# EAGLE board tc08nh (EAGLE 6.6.0), part 1 of 5
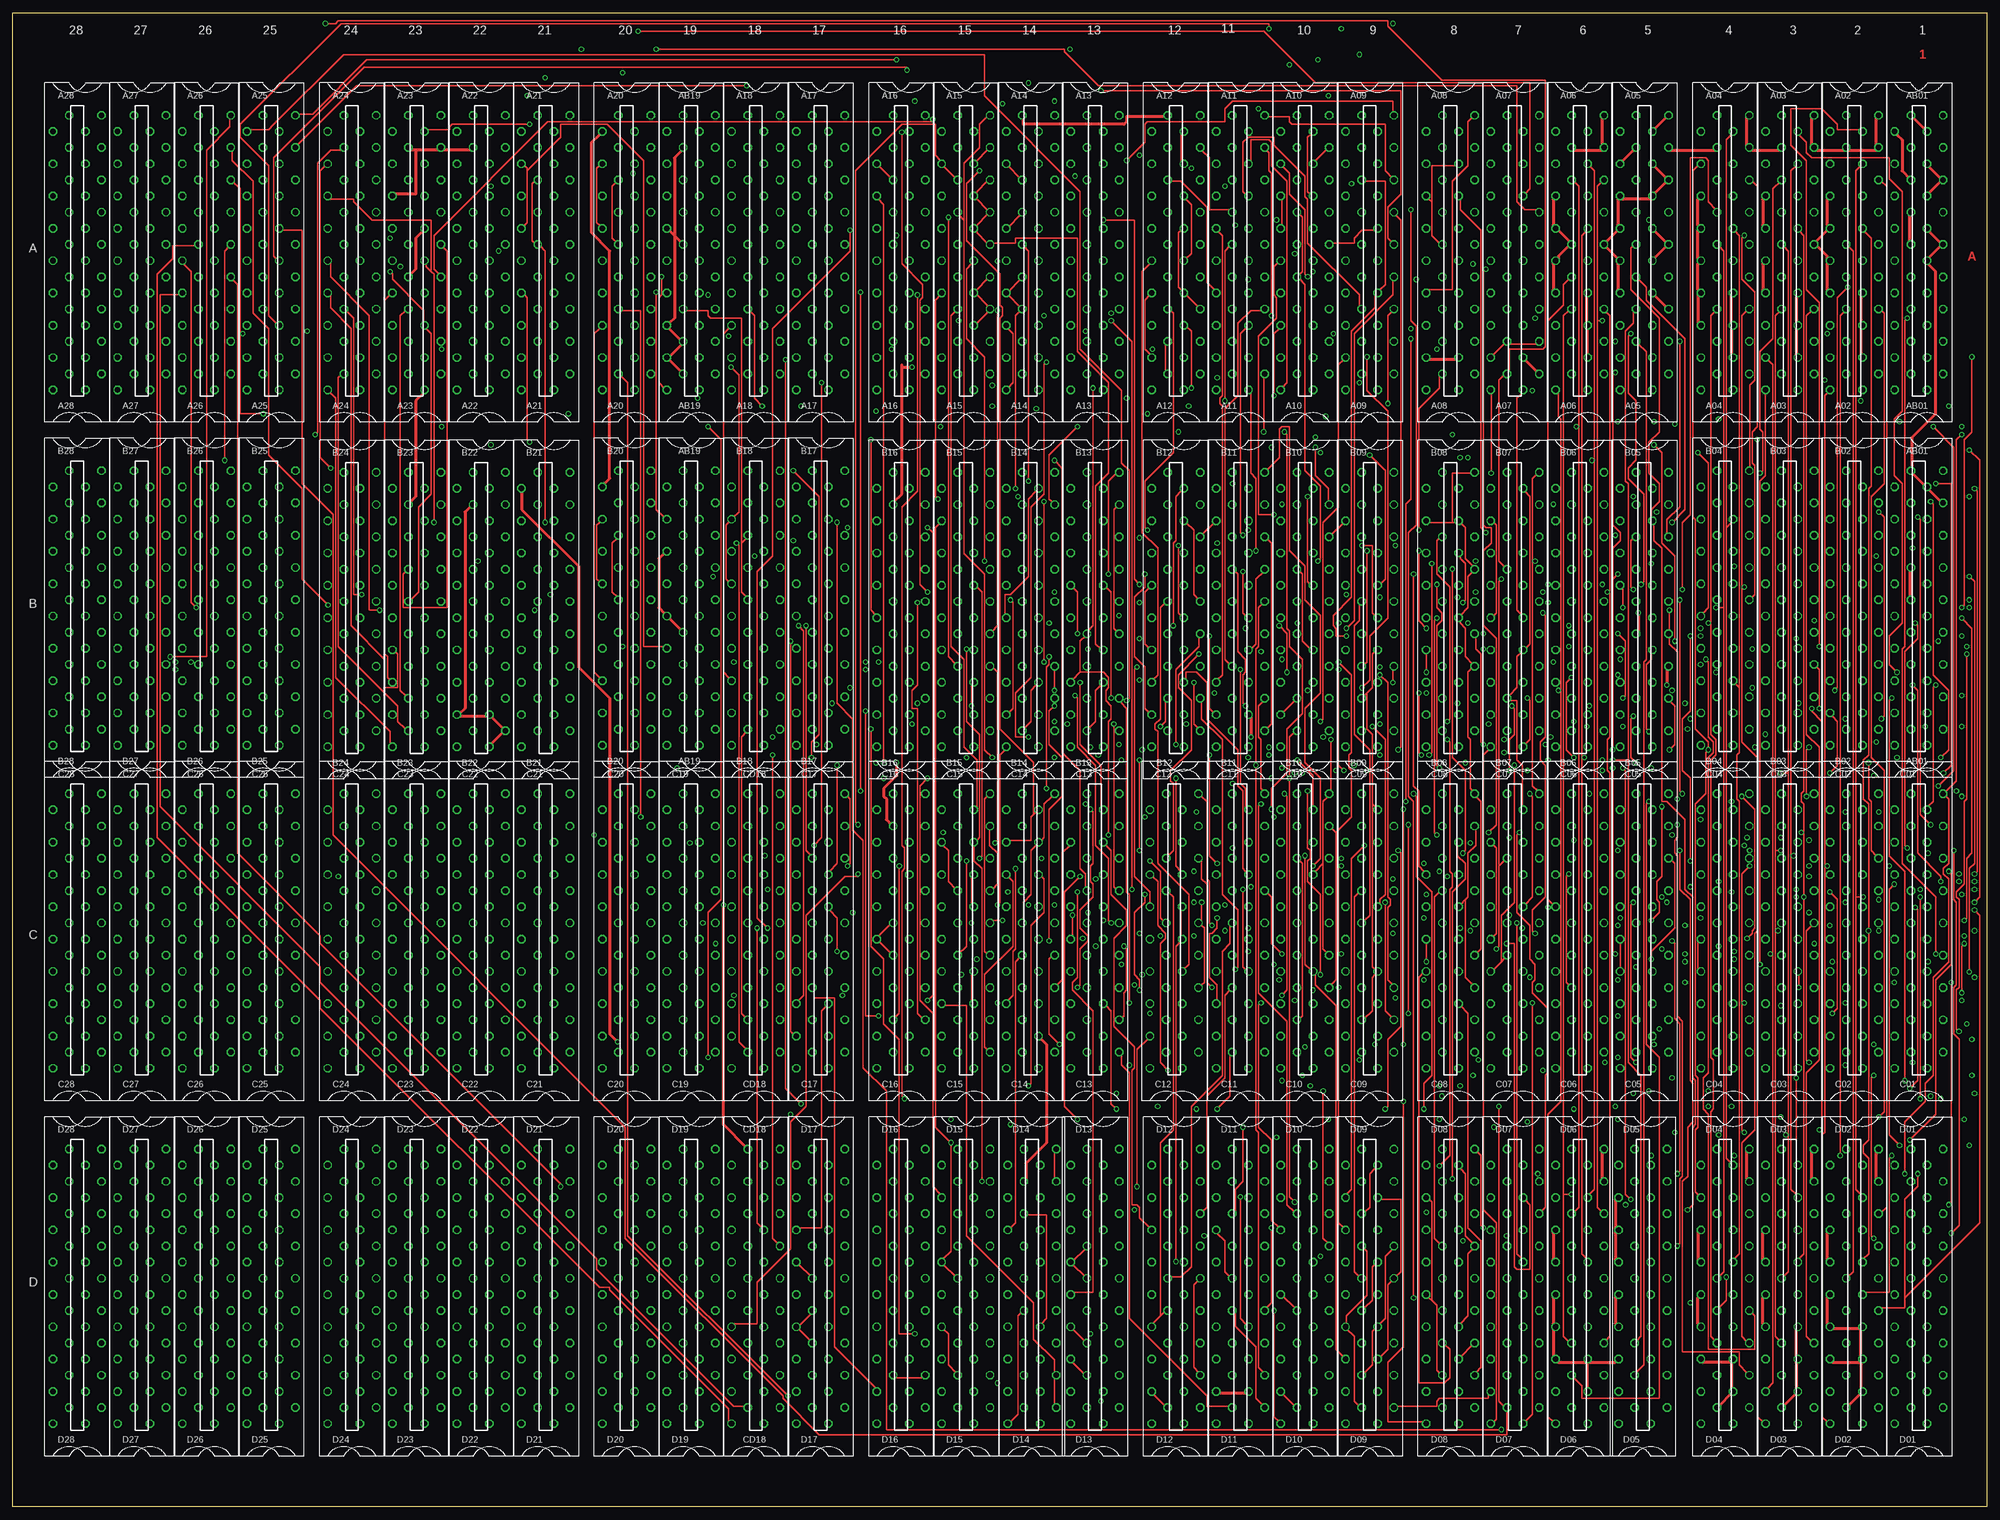
[diagram p12: board, top side]
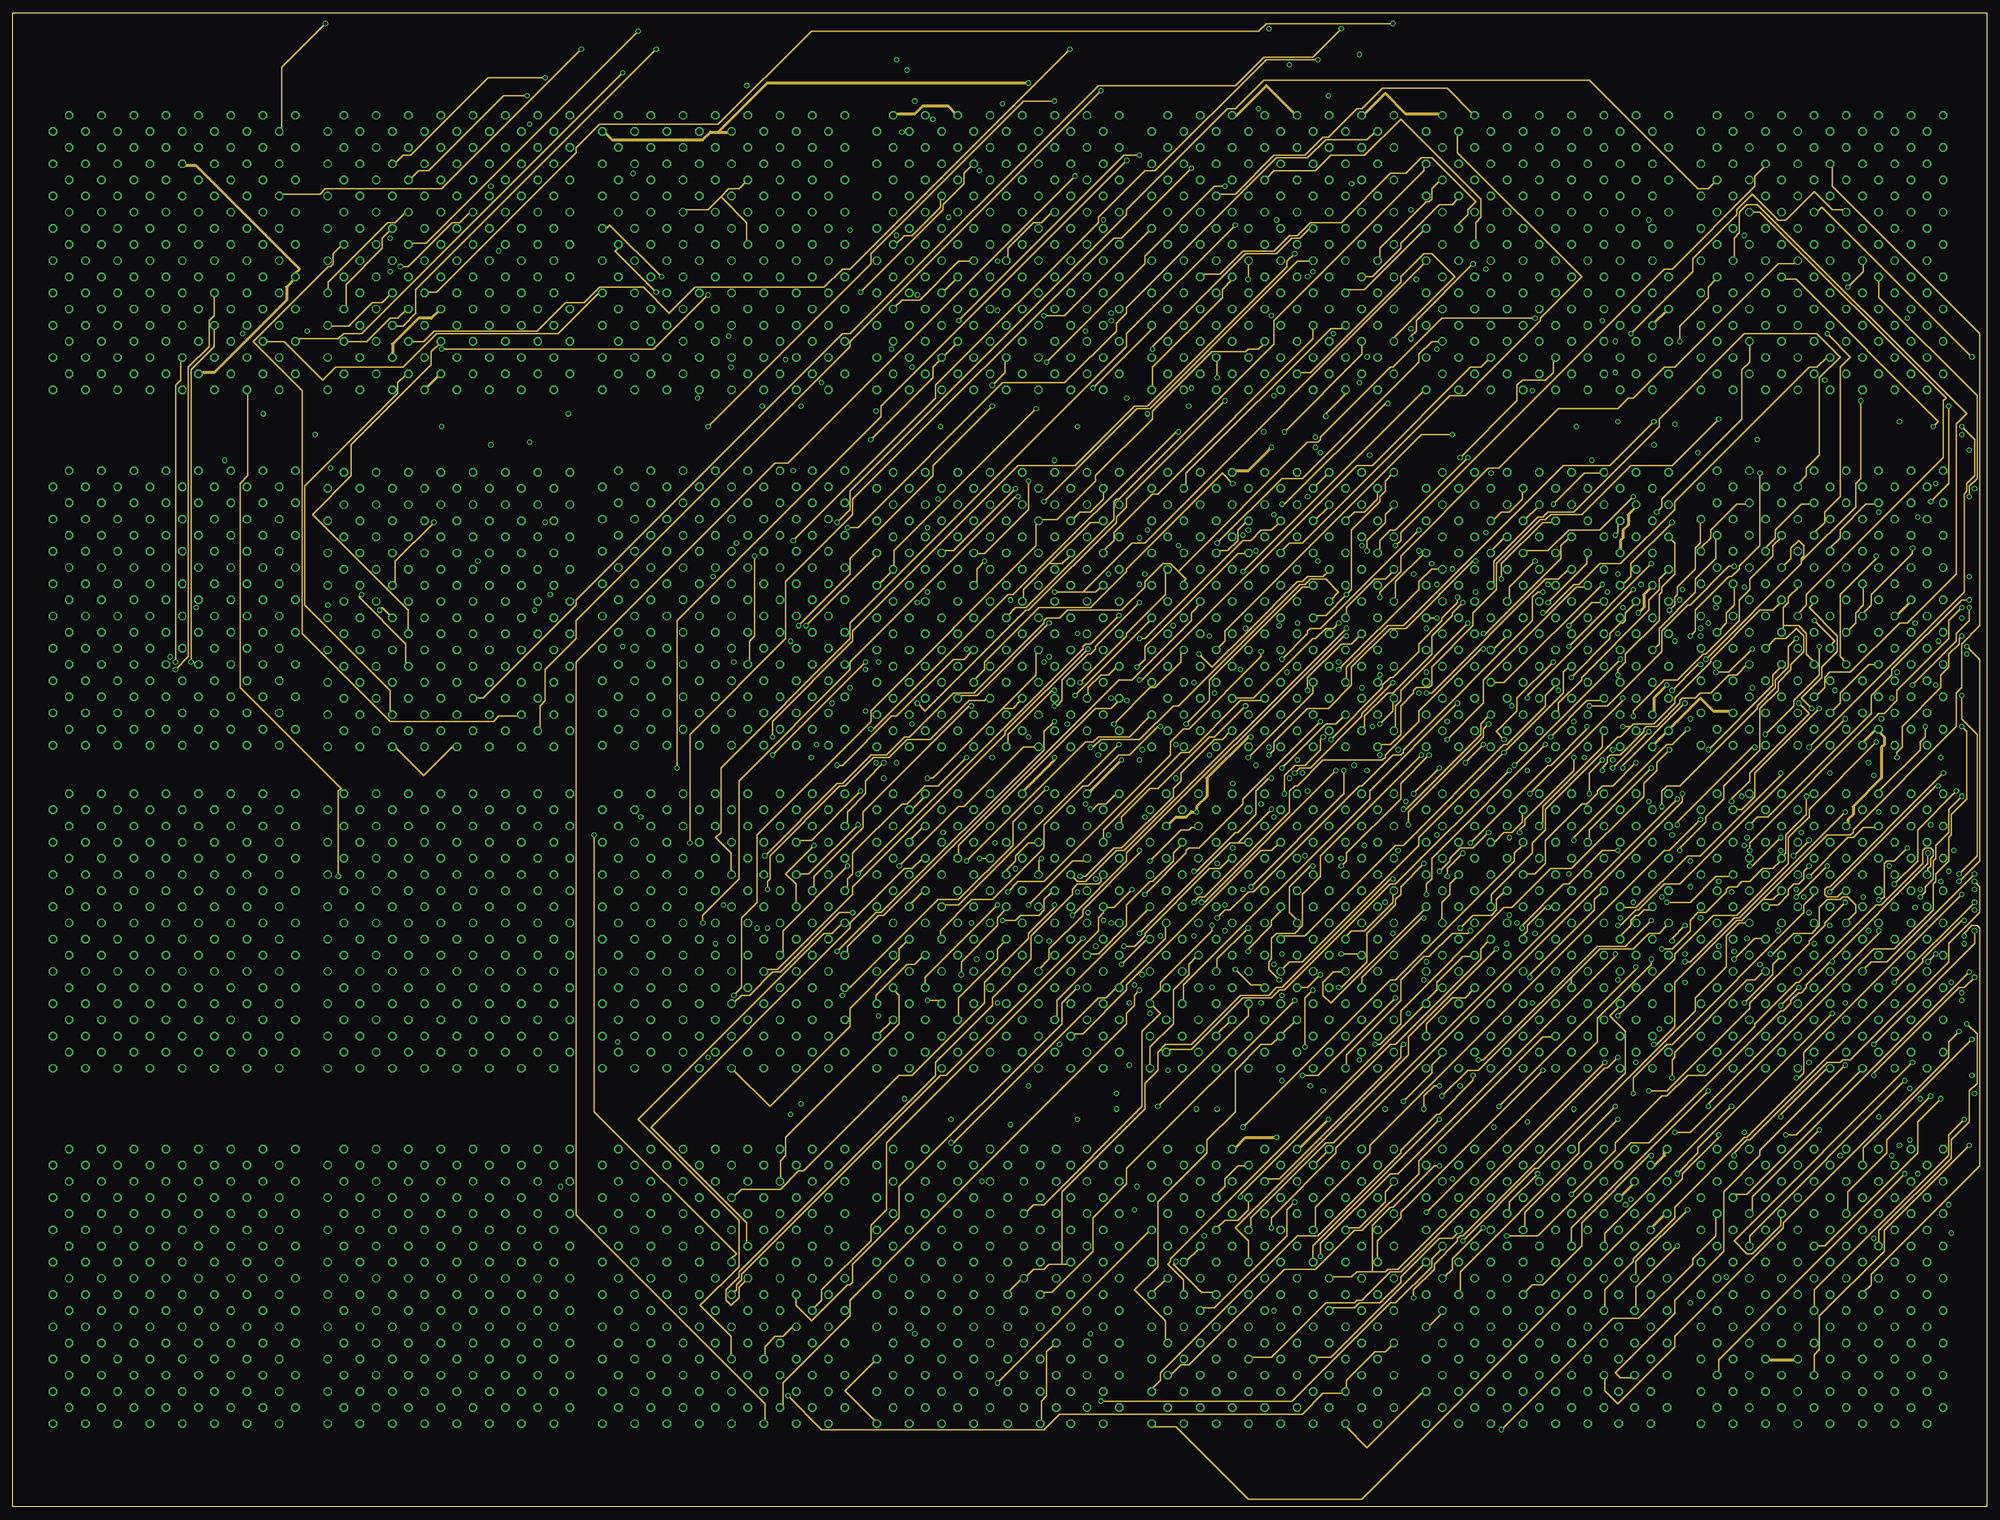
[diagram p13: board, inner layer Route2]
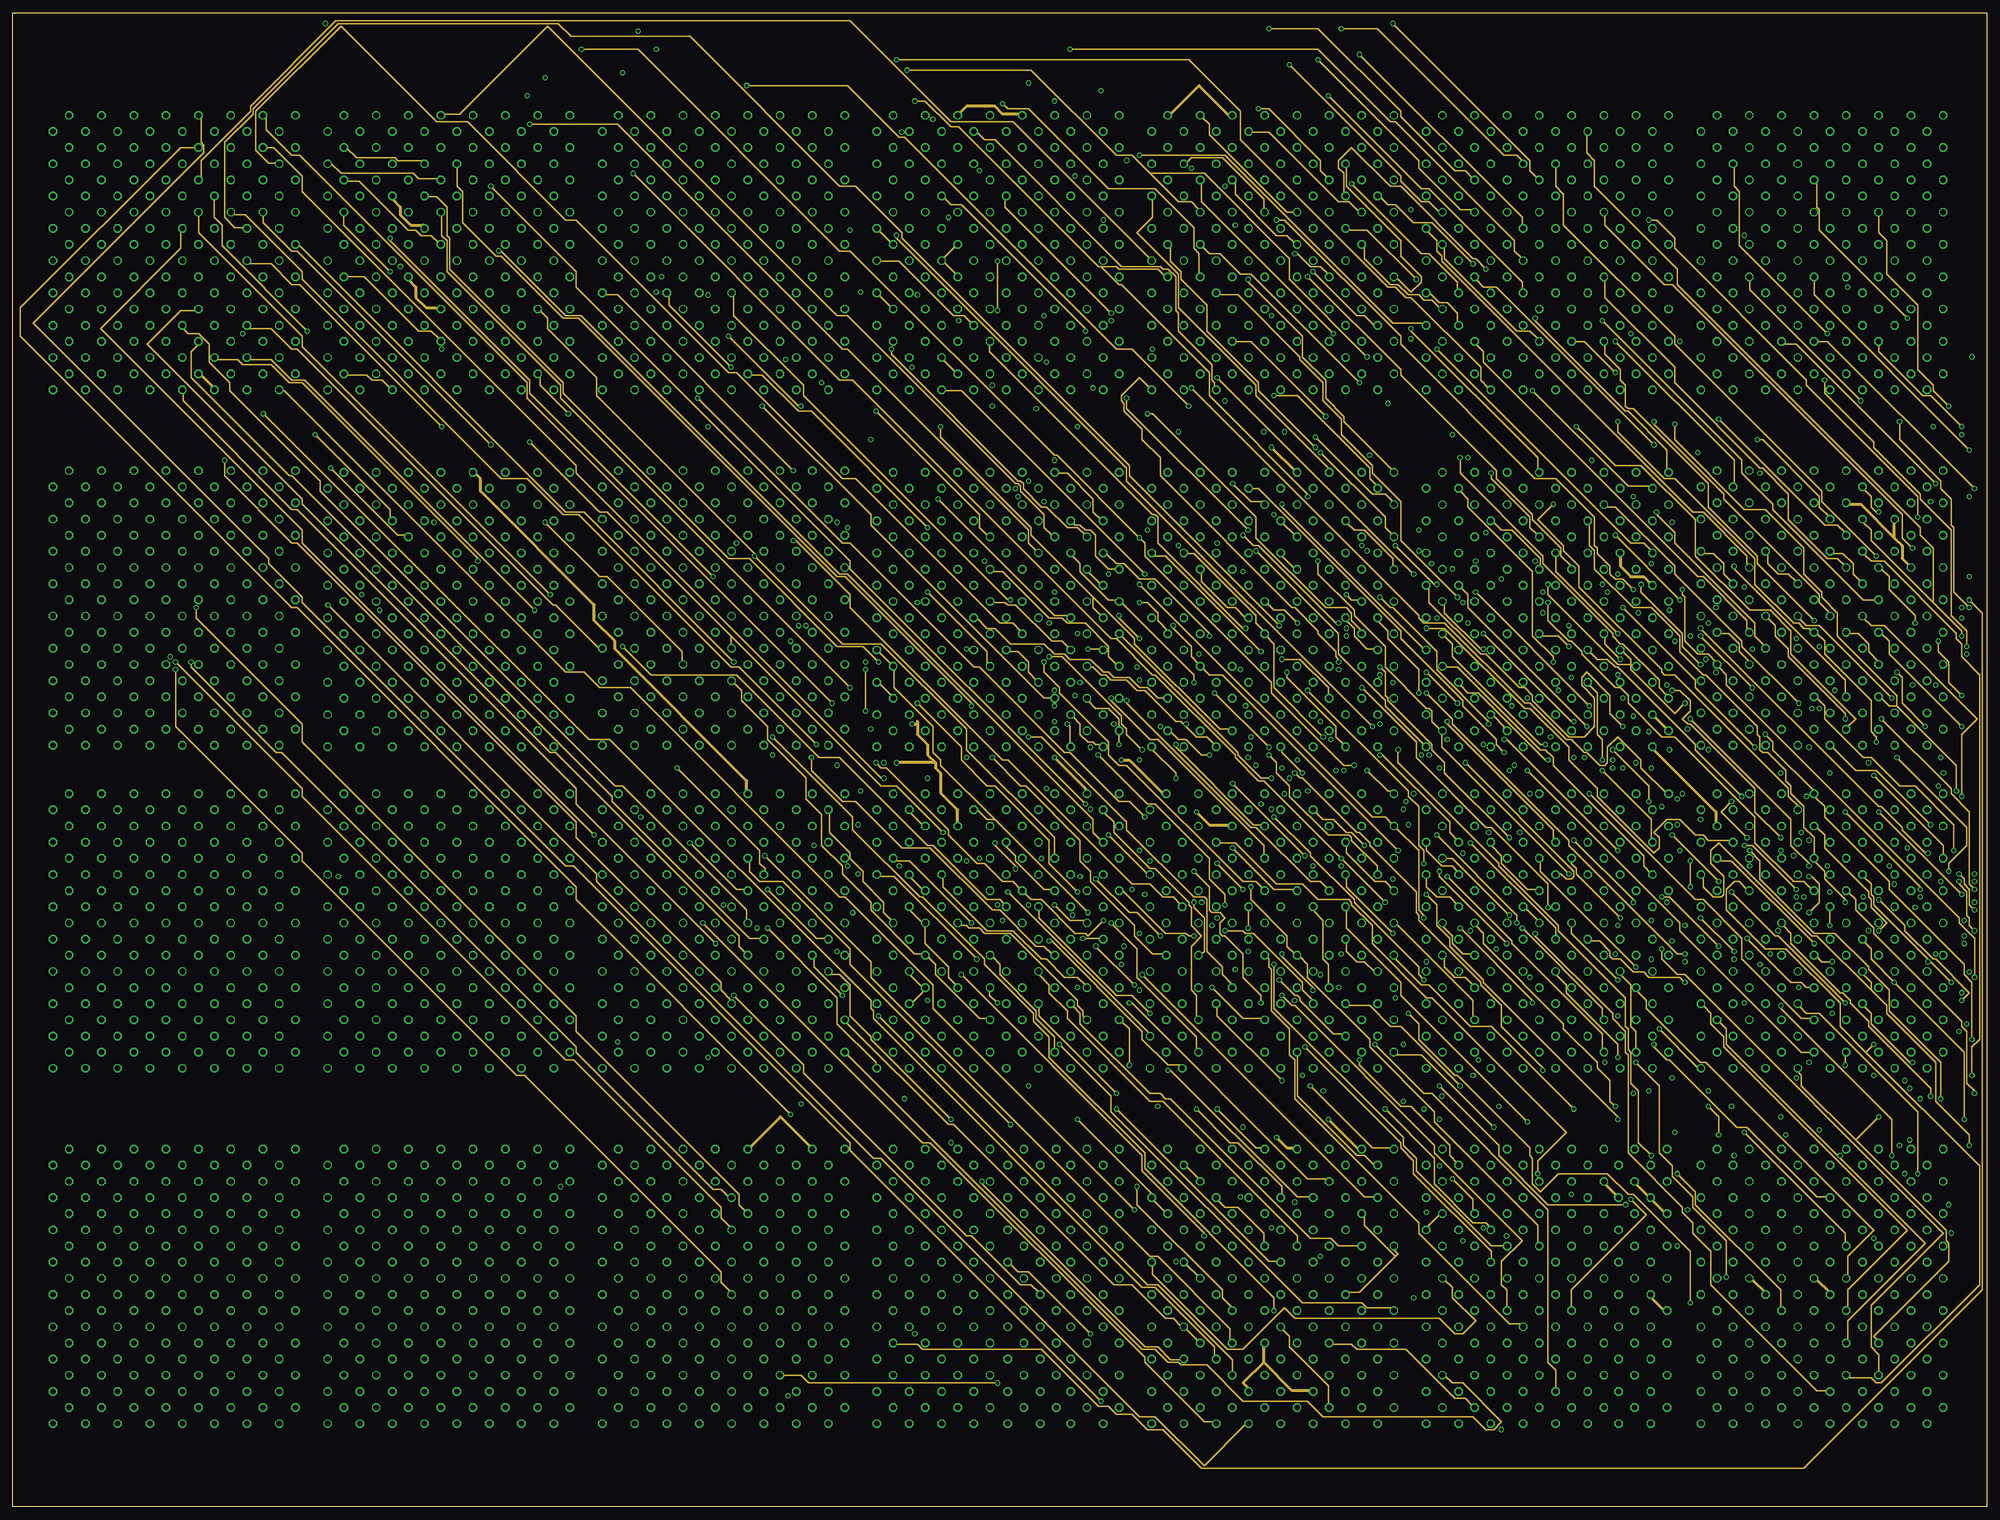
[diagram p14: board, inner layer Route15]
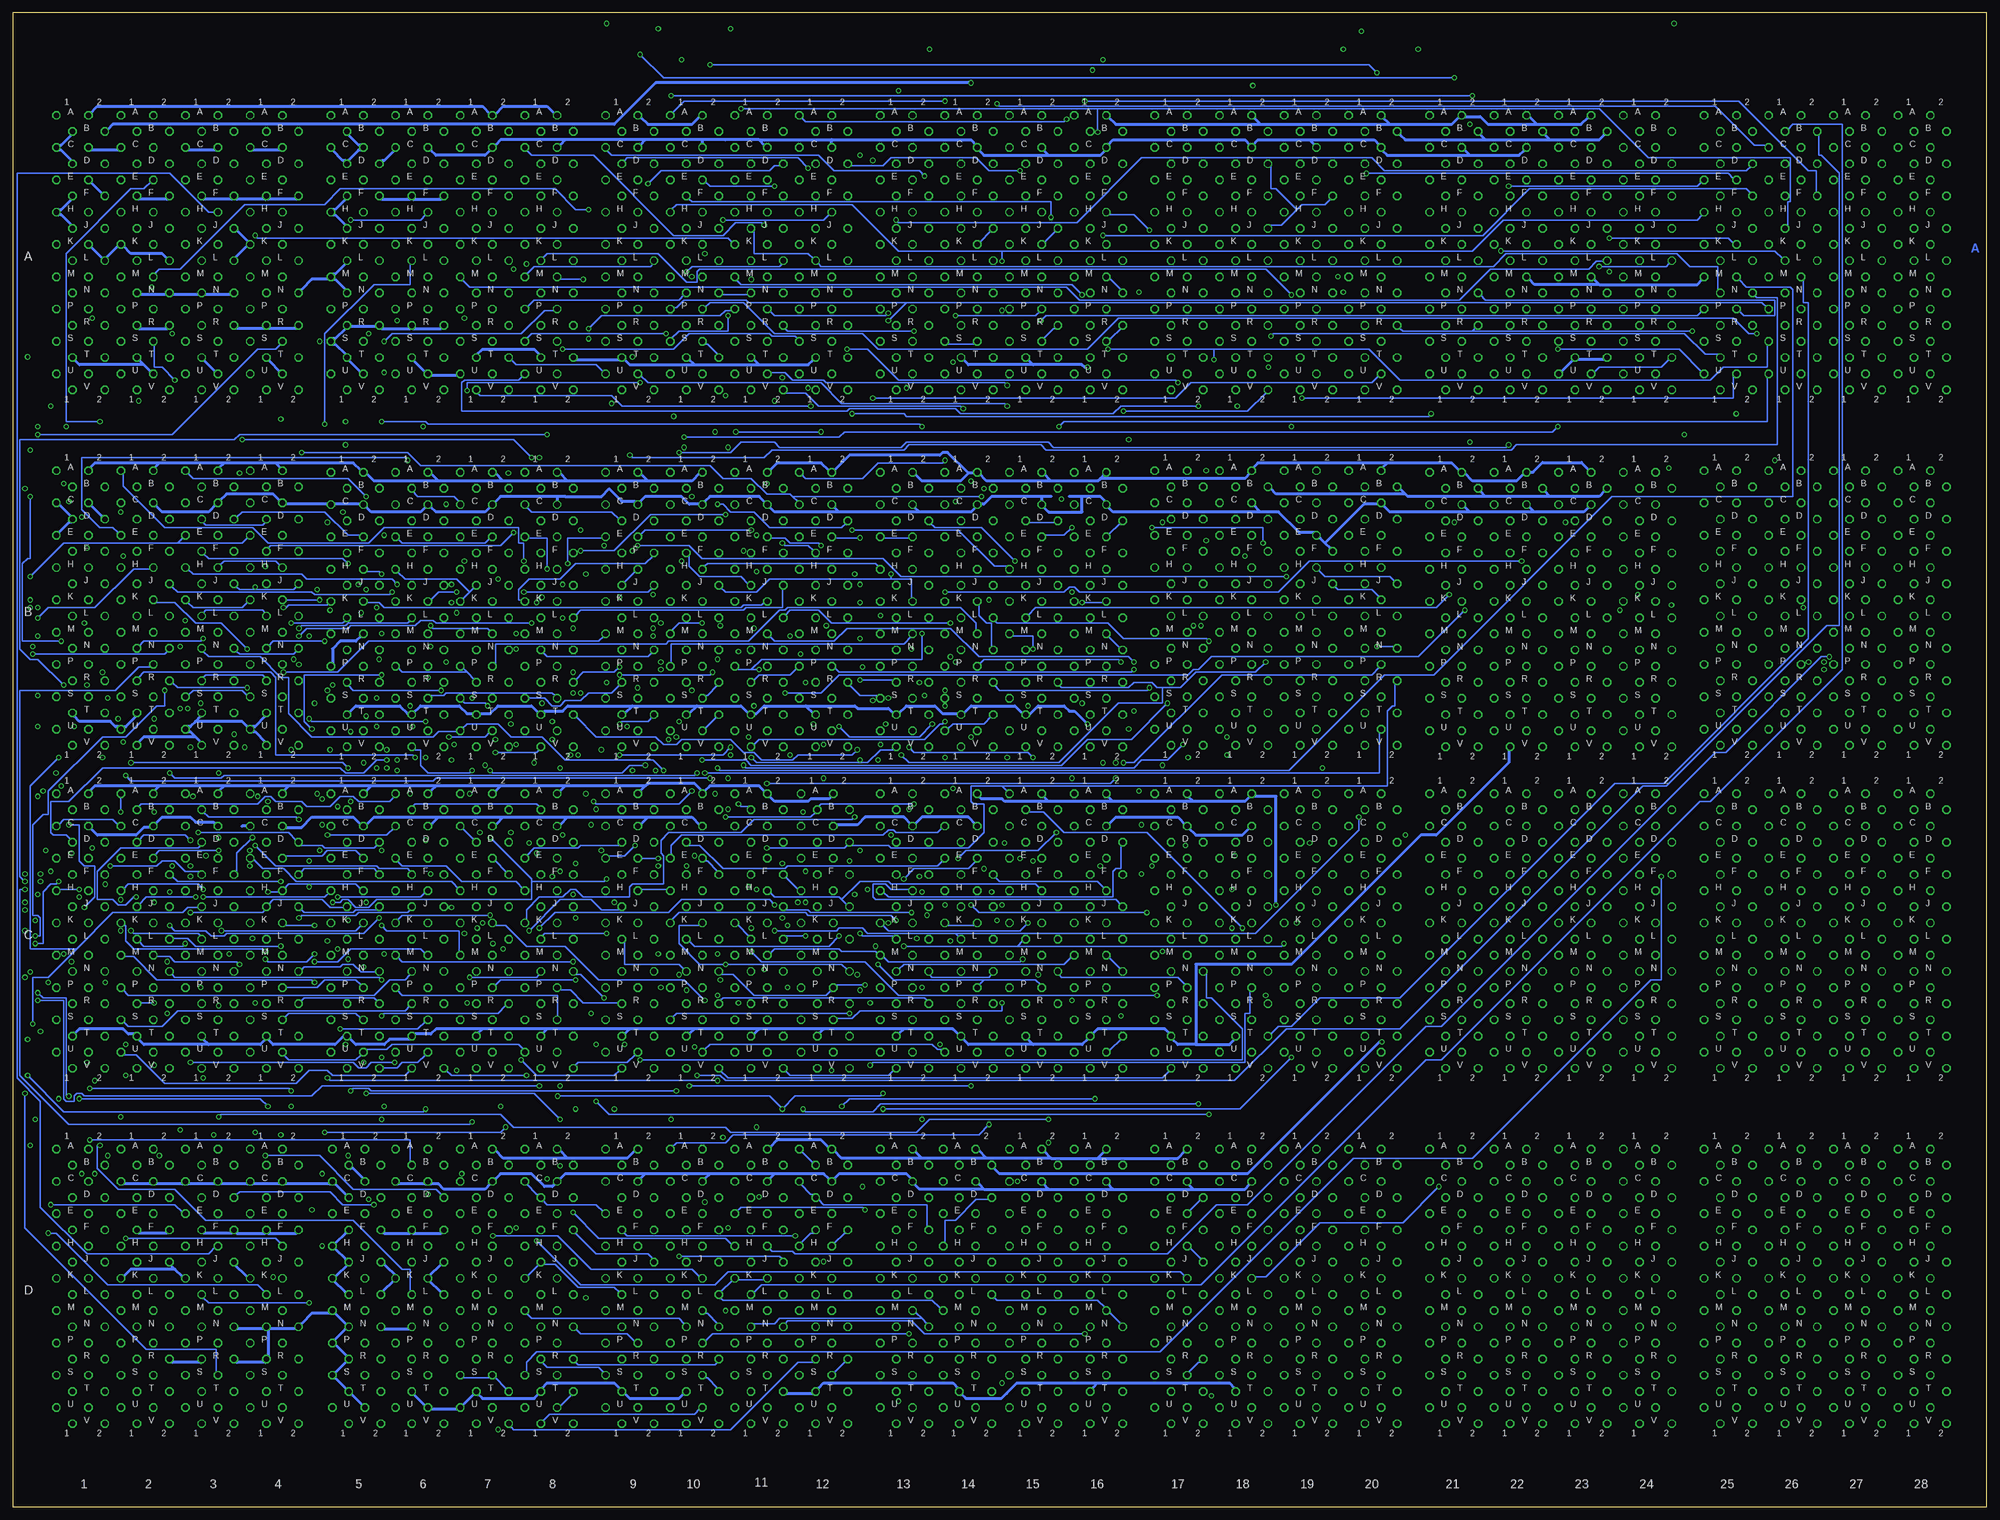
[diagram p15: board, bottom side, seen from below]

Size 387.97 x 293.68 mm. Coordinates in mm from the lower left corner, seen from the top.
Outline: 387.97,0 0,0 0,293.68 387.97,293.68 387.97,0
Copper layers (1*2*15*16): Top 0.035mm / dielectric 1.5mm / Route2 0.035mm / dielectric 0.15mm / Route15 0.035mm / dielectric 0.2mm / Bottom 0.035mm
Design rules "10mils *": minimum track width 10mil, minimum drill 24mil, track to track 10mil, track to pad 5mil, pad to pad 5mil, via to via 5mil, smd to smd 0mil, copper to edge 15mil, drill to drill 10mil, minimum pad ring 10mil, minimum via ring 8mil, stop-mask expansion 0mil, vias tented up to drill 0mil, thermal gap 10mil
Net classes: 1 Power: width 0.635 mm, drill 0.381 mm, clearance 0.254 mm

## Footprints (pad centres in the part's own frame; a part is rotated, then mirrored left to right if it is on the bottom)
H807 = drill 1.092 octagon: A1 4.763,28.575; A2 -1.587,28.575; B1 1.587,25.4; B2 -4.763,25.4; C1 4.763,22.225; C2 -1.587,22.225; D1 1.587,19.05; D2 -4.763,19.05; E1 4.763,15.875; E2 -1.587,15.875; F1 1.587,12.7; F2 -4.763,12.7; H1 4.763,9.525; H2 -1.587,9.525; J1 1.587,6.35; J2 -4.763,6.35; K1 4.763,3.175; K2 -1.587,3.175; L1 1.587,0; L2 -4.763,0; M1 4.763,-3.175; M2 -1.587,-3.175; N1 1.587,-6.35; N2 -4.763,-6.35; P1 4.763,-9.525; P2 -1.587,-9.525; R1 1.587,-12.7; R2 -4.763,-12.7; S1 4.763,-15.875; S2 -1.587,-15.875; T1 1.587,-19.05; T2 -4.763,-19.05; U1 4.763,-22.225; U2 -1.587,-22.225; V1 1.587,-25.4; V2 -4.763,-25.4
H807-2 = drill 1.092 octagon: AA1 4.763,60.325; AA2 -1.587,60.325; AB1 1.587,57.15; AB2 -4.763,57.15; AC1 4.763,53.975; AC2 -1.587,53.975; AD1 1.587,50.8; AD2 -4.763,50.8; AE1 4.763,47.625; AE2 -1.587,47.625; AF1 1.587,44.45; AF2 -4.763,44.45; AH1 4.763,41.275; AH2 -1.587,41.275; AJ1 1.587,38.1; AJ2 -4.763,38.1; AK1 4.763,34.925; AK2 -1.587,34.925; AL1 1.587,31.75; AL2 -4.763,31.75; AM1 4.763,28.575; AM2 -1.587,28.575; AN1 1.587,25.4; AN2 -4.763,25.4; AP1 4.763,22.225; AP2 -1.587,22.225; AR1 1.587,19.05; AR2 -4.763,19.05; AS1 4.763,15.875; AS2 -1.587,15.875; AT1 1.587,12.7; AT2 -4.763,12.7; AU1 4.763,9.525; AU2 -1.587,9.525; AV1 1.587,6.35; AV2 -4.763,6.35; BA1 4.763,-9.525; BA2 -1.587,-9.525; BB1 1.587,-12.7; BB2 -4.763,-12.7; BC1 4.763,-15.875; BC2 -1.587,-15.875; BD1 1.587,-19.05; BD2 -4.763,-19.05; BE1 4.763,-22.225; BE2 -1.587,-22.225; BF1 1.587,-25.4; BF2 -4.763,-25.4; BH1 4.763,-28.575; BH2 -1.587,-28.575; BJ1 1.587,-31.75; BJ2 -4.763,-31.75; BK1 4.763,-34.925; BK2 -1.587,-34.925; BL1 1.587,-38.1; BL2 -4.763,-38.1; BM1 4.763,-41.275; BM2 -1.587,-41.275; BN1 1.587,-44.45; BN2 -4.763,-44.45; BP1 4.763,-47.625; BP2 -1.587,-47.625; BR1 1.587,-50.8; BR2 -4.763,-50.8; BS1 4.763,-53.975; BS2 -1.587,-53.975; BT1 1.587,-57.15; BT2 -4.763,-57.15; BU1 4.763,-60.325; BU2 -1.587,-60.325; BV1 1.587,-63.5; BV2 -4.763,-63.5

## Placement (x,y rotation side)
A02  M903  [H807]  361.94,244.94 0 top
A03  M903  [H807]  349.24,244.94 0 top
A04  M903  [H807]  336.54,244.94 0 top
A05  M903  [H807]  320.66,244.94 0 top
A06  M903  [H807]  307.96,244.94 0 top
A07  M161  [H807]  295.26,244.94 0 top
A08  M206  [H807]  282.56,244.94 0 top
A09  M117  [H807]  266.69,244.94 0 top
A10  M113  [H807]  253.99,244.94 0 top
A11  M111  [H807]  241.29,244.94 0 top
A12  M113  [H807]  228.59,244.94 0 top
A13  H807  [H807]  212.71,244.94 0 top
A14  M302  [H807]  200.01,244.94 0 top
A15  M627  [H807]  187.31,244.94 0 top
A16  M602  [H807]  174.61,244.94 0 top
A17  H807  [H807]  158.74,244.94 0 top
A18  G888  [H807]  146.04,244.94 0 top
A20  G888  [H807]  120.64,244.94 0 top
A21  G888  [H807]  104.76,244.94 0 top
A22  M502  [H807]  92.06,244.94 0 top
A23  M633  [H807]  79.36,244.94 0 top
A24  W023  [H807]  66.66,244.94 0 top
A25  M916  [H807]  50.78,244.94 0 top
A26  M916  [H807]  38.09,244.94 0 top
A27  H807  [H807]  25.38,244.94 0 top
A28  H807  [H807]  12.68,244.94 0 top
AB01  G821  [H807-2]  374.63,213.19 0 top
AB19  W032  [H807-2]  133.34,213.19 0 top
B02  M623  [H807]  361.94,175.09 0 top
B03  M623  [H807]  349.24,175.09 0 top
B04  M623  [H807]  336.54,175.09 0 top
B05  M623  [H807]  320.66,174.78 0 top
B06  M111  [H807]  307.96,174.78 0 top
B07  M207  [H807]  295.26,174.78 0 top
B08  M113  [H807]  282.56,174.78 0 top
B09  M206  [H807]  266.69,174.78 0 top
B10  M627  [H807]  253.99,174.78 0 top
B11  M115  [H807]  241.29,174.78 0 top
B12  M117  [H807]  228.59,174.78 0 top
B13  M206  [H807]  212.71,174.78 0 top
B14  M206  [H807]  200.01,174.78 0 top
B15  M113  [H807]  187.31,174.78 0 top
B16  M602  [H807]  174.61,174.78 0 top
B17  H807  [H807]  158.74,175.09 0 top
B18  G888  [H807]  146.04,175.09 0 top
B20  G888  [H807]  120.64,175.09 0 top
B21  G879  [H807]  104.76,174.78 0 top
B22  M633  [H807]  92.06,174.78 0 top
B23  W005  [H807]  79.36,174.78 0 top
B24  H807  [H807]  66.66,174.78 0 top
B25  H807  [H807]  50.78,175.09 0 top
B26  H807  [H807]  38.09,175.09 0 top
B27  H807  [H807]  25.38,175.09 0 top
B28  H807  [H807]  12.68,175.09 0 top
C01  M101  [H807]  374.63,111.59 0 top
C02  M101  [H807]  361.94,111.59 0 top
C03  M101  [H807]  349.24,111.59 0 top
C04  M103  [H807]  336.54,111.59 0 top
C05  M103  [H807]  320.66,111.59 0 top
C06  M111  [H807]  307.96,111.59 0 top
C07  M207  [H807]  295.26,111.59 0 top
C08  M121  [H807]  282.56,111.59 0 top
C09  M206  [H807]  266.69,111.59 0 top
C10  M121  [H807]  253.99,111.59 0 top
C11  M113  [H807]  241.29,111.59 0 top
C12  M115  [H807]  228.27,111.59 0 top
C13  M111  [H807]  212.71,111.59 0 top
C14  M206  [H807]  200.01,111.59 0 top
C15  M113  [H807]  187.31,111.59 0 top
C16  M627  [H807]  174.61,111.59 0 top
C17  M111  [H807]  158.74,111.59 0 top
C19  H807  [H807]  133.34,111.59 0 top
C20  H807  [H807]  120.64,111.59 0 top
C21  H807  [H807]  104.76,111.59 0 top
C22  H807  [H807]  92.06,111.59 0 top
C23  H807  [H807]  79.36,111.59 0 top
C24  H807  [H807]  66.66,111.59 0 top
C25  H807  [H807]  50.78,111.59 0 top
C26  H807  [H807]  38.09,111.59 0 top
C27  H807  [H807]  25.38,111.59 0 top
C28  H807  [H807]  12.68,111.59 0 top
CD18  M228  [H807-2]  146.04,79.84 0 top
D01  H807  [H807]  374.63,41.74 0 top
D02  M903  [H807]  361.94,41.74 0 top
D03  M903  [H807]  349.24,41.74 0 top
D04  M903  [H807]  336.54,41.74 0 top
D05  M903  [H807]  320.34,41.74 0 top
D06  M903  [H807]  307.96,41.74 0 top
D07  M161  [H807]  295.26,41.74 0 top
D08  M207  [H807]  282.56,41.74 0 top
D09  M121  [H807]  266.69,41.74 0 top
D10  M119  [H807]  253.99,41.74 0 top
D11  M206  [H807]  241.29,41.74 0 top
D12  M627  [H807]  228.59,41.74 0 top
D13  M602  [H807]  212.71,41.74 0 top
D14  M307  [H807]  200.33,41.74 0 top
D15  M401  [H807]  187.31,41.74 0 top
D16  M302  [H807]  174.61,41.74 0 top
D17  M602  [H807]  158.74,41.74 0 top
D19  H807  [H807]  133.34,41.74 0 top
D20  H807  [H807]  120.64,41.74 0 top
D21  H807  [H807]  104.76,41.74 0 top
D22  H807  [H807]  92.06,41.74 0 top
D23  H807  [H807]  79.36,41.74 0 top
D24  H807  [H807]  66.66,41.74 0 top
D25  H807  [H807]  50.78,41.74 0 top
D26  H807  [H807]  38.09,41.74 0 top
D27  H807  [H807]  25.38,41.74 0 top
D28  H807  [H807]  12.68,41.74 0 top

## Tracks (layer width: path | path; a pad name or v marks a point on that pad's centre or on a via)
0_TO_DTB  (via drill 0.61)
  Top 0.254: v175.25,80.23 174.74,80.73 174.74,124.93 175.25,125.44 175.25,129.5 174.74,130.01 174.74,196.56 177.79,199.61 v177.79,238.21
  Route2 0.254: v225.03,78.7 242.81,96.48 242.81,98.51 C11.R1
  Bottom 0.254: v225.03,78.7 223.51,80.23 v175.25,80.23 | v177.79,238.21 179.82,240.25 244.84,240.25 245.86,241.26 A11.M1
0_TO_EF
  Route15 0.254: A11.E2 240.27,260.57 240.27,258.03 248.4,249.9 250.43,249.9 251.95,248.37 A10.K2
0_TO_STA
  Bottom 0.254: A11.N1 243.32,238.21 248.91,238.21 A10.N2
1_TO_DF  (via drill 0.61)
  Top 0.254: C12.J1 229.6,117.31 229.6,112.23 C12.L1 229.6,111.21 228.59,110.2 v228.59,48.22
  Route2 0.254: v228.59,48.22 228.08,47.71 233.67,42.13 236.21,42.13 D11.L2 | v256.53,284.44 246.37,284.44 224.52,262.6 222.49,262.6 213.35,253.45 213.35,252.44 181.34,220.43 181.34,217.89 v153.4,189.95
  Route15 0.254: v256.53,284.44 276.34,264.63 276.34,263.11 284.47,254.98 287,254.98 A08.H1 | v153.4,189.95 153.91,189.95 164.58,179.29 164.58,176.75 194.55,146.77 195.57,146.77 219.95,122.39 223.51,122.39 226.05,119.85 228.08,119.85 229.6,118.33 C12.J1
1_TO_DTF  (via drill 0.61)
  Top 0.254: v170.17,96.48 167.62,96.48 v167.62,156.43
  Route15 0.254: v170.17,96.48 223,43.65 225.03,43.65 239.76,28.92 239.76,26.38 D11.S2 | v167.62,156.43 v167.62,164.55
  Bottom 0.254: v167.62,164.55 168.13,164.05 225.54,164.05 226.55,165.06 B12.P2
76  (via drill 0.61)
  Route15 0.254: v323.58,93.94 331.2,86.32 C04.V2
  Bottom 0.254: v323.58,93.94 308.34,93.94 306.82,95.47 C06.S2
76+77  (via drill 0.61)
  Route2 0.254: v335.26,73.11 335.26,72.61 328.15,65.49 328.15,64.48 265.16,1.49 242.81,1.49 228.59,15.71 224.01,15.71 D12.V2 | v333.23,78.7 333.23,79.21 366.76,112.74 v366.76,113.25
  Route15 0.254: v335.26,73.11 335.26,76.67 v333.23,78.7 | v366.76,113.25 368.29,114.77 365.24,117.82 365.24,119.34 364.73,119.85 364.73,120.87 356.09,129.5 356.09,132.04 354.57,133.57 C03.C1
77
  Bottom 0.254: C06.U2 306.82,88.86 308.34,87.34 311.39,87.34 312.41,86.32 315.45,86.32 C05.V2
!00  (via drill 0.61)
  Route2 0.254: v261.1,290.54 255.51,284.95 245.86,284.95 240.27,279.36 213.35,279.36 164.58,230.59 163.05,230.59 110.73,178.27 110.73,177.25 92.44,158.97 90.92,158.97 B22.S2
  Route15 0.254: v261.1,290.54 268.21,290.54 293.1,265.65 295.64,265.65 296.66,264.63 A07.D1
!0_TO_AC
  Route2 0.254: B06.T2 303.77,155.92 303.77,157.95 308.34,162.52 308.34,163.03 321.55,176.24 321.55,178.27 323.58,180.3 323.58,182.33 325.11,183.86 B05.H1
!0_TO_DTB  (via drill 0.61)
  Top 0.254: 266.69,144.74 266.69,148.81 263.64,151.85 263.64,173.19 264.65,174.21 264.65,177.76 B09.K2 | 266.69,144.74 266.69,116.29 265.67,115.28 C09.K2 | 266.69,144.74 v266.18,144.74
  Route2 0.254: B10.L1 256.02,175.22 258.05,175.22 v262.11,179.29 263.13,180.3 263.13,191.99 268.72,197.57 268.72,198.59 269.73,199.61 269.73,201.64 271.26,203.16 B09.A1 | v242.81,241.26 242.81,244.31 A11.L1
  Route15 0.254: v266.18,144.74 270.24,140.68 271.26,140.68 C09.A1 | v242.81,241.26 242.81,240.75 253.48,230.09 253.48,226.02 258.05,221.45 258.05,217.89 261.61,214.34 261.61,213.32 271.26,203.67 B09.A1 | v262.11,179.29 263.13,178.27 264.65,178.27 B09.K2
!0_TO_EF
  Top 0.254: A08.N2 278.37,239.23 282.94,239.23 282.94,260.57 285.99,263.61 285.99,272.25 287,273.27 A08.A1
  Route2 0.254: A11.F2 236.71,258.03 240.27,258.03 247.89,265.65 253.99,265.65 257.54,269.2 258.56,269.2 264.15,274.79 265.16,274.79 269.23,278.85 281.93,278.85 287,273.77 A08.A1
  Route15 0.254: A08.R1 283.96,232.63 283.96,234.66 281.93,236.69 280.4,236.69 278.37,238.72 A08.N2
!0_TO_LPB  (via drill 0.61)
  Top 0.254: v289.04,54.83 288.53,55.33 288.53,69.05 287.51,70.07 D08.A1
  Route2 0.254: v289.04,54.83 282.94,48.73 282.94,46.7 281.42,45.17 D08.K2
  Route15 0.254: D12.J2 224.01,47.71 224.01,45.68 238.75,30.95 241.79,30.95 249.92,39.08 251.95,37.05 280.4,37.05 283.45,34 284.97,34 287.51,36.54 282.94,41.11 282.94,43.14 281.42,44.67 D08.K2
!0_TO_STA  (via drill 0.61)
  Top 0.254: 298.69,185.89 298.69,202.15 299.71,203.16 B07.A1 | 298.69,185.89 298.69,141.69 299.71,140.68 C07.A1 | 298.69,185.89 v299.2,185.89 | B11.P2 239.25,165.57 238.24,166.59 238.24,215.86 240.78,218.4 240.78,232.63 243.32,235.17 245.86,235.17 A11.P1
  Route2 0.254: v299.2,185.89 294.12,180.81 294.12,178.27 B07.K2
  Route15 0.254: v274.81,231.61 274.81,231.1 299.71,206.21 299.71,203.67 B07.A1
  Bottom 0.254: v274.81,231.61 272.27,234.15 248.91,234.15 247.89,235.17 246.37,235.17 A11.P1
!0_TO_STATE
  Route2 0.254: CD18.AV2 141.72,85.81 148.83,78.7 164.58,94.45 164.58,98.01 174.23,107.66 174.23,109.69 175.75,111.21 C16.L1
!0_TO_W
  Route2 0.254: CD18.BH2 144.26,51.78 144.26,55.84 125.46,74.64 164.58,113.75 164.58,114.77 175.25,125.44 176.77,125.44 178.8,127.47 C16.E1
!01  (via drill 0.61)
  Route2 0.254: v271.26,291.55 246.37,291.55 244.84,290.03 156.96,290.03 138.67,271.74 115.3,271.74 110.73,267.17 110.73,266.15 83.3,238.72 81.27,238.72 A23.N1
  Route15 0.254: v271.26,291.55 298.18,264.63 298.18,262.6 299.71,261.07 A07.E1
!02  (via drill 0.61)
  Route2 0.254: v104.63,280.89 93.46,280.89 78.22,265.65 76.69,265.65 75.17,264.12 A23.D2
  Route15 0.254: v264.65,285.46 296.66,253.45 296.66,251.93 A07.J1
  Bottom 0.254: v264.65,285.46 260.08,280.89 v104.63,280.89
!03  (via drill 0.61)
  Route2 0.254: v101.08,277.33 96.5,277.33 81.77,262.6 79.74,262.6 78.22,261.07 A23.E2
  Route15 0.254: v258.56,277.33 276.85,259.04 278.37,259.04 296.66,240.75 296.66,239.23 A07.N1
  Bottom 0.254: v258.56,277.33 v101.08,277.33
!04  (via drill 0.61)
  Top 0.254: v122.92,290.03 245.86,290.03 256.02,279.87 298.18,279.87 298.18,259.04 297.17,258.03 A07.F1
  Route2 0.254: v122.92,290.03 81.27,248.37 78.22,248.37 A23.K2
!05
  Bottom 0.254: A07.M1 299.71,241.26 298.18,239.74 180.83,239.74 178.29,237.2 103.62,237.2 97.52,243.29 78.22,243.29 76.69,244.82 75.17,244.82 A23.L2
!06  (via drill 0.61)
  Top 0.254: v126.48,286.47 206.74,286.47 206.74,285.97 213.35,279.36 295.64,279.36 295.64,256.5 297.17,254.98 299.71,254.98 A07.H1
  Route2 0.254: v126.48,286.47 79.23,239.23 79.23,234.66 76.69,232.12 75.17,232.12 A23.R2
!07  (via drill 0.61)
  Route2 0.254: v207.76,286.47 164.58,243.29 163.05,243.29 159.5,239.74 134.1,239.74 129.02,234.66 123.94,239.74 115.3,239.74 112.25,236.69 108.7,236.69 103.11,231.1 82.79,231.1 80.76,229.07 78.22,229.07 A23.S2
  Route15 0.254: v207.76,286.47 256.53,286.47 270.75,272.25 271.76,272.25 295.13,248.88 295.13,246.85 296.66,245.33 A07.L1
!76
  Route2 0.254: C06.T2 302.75,92.42 300.72,92.42 276.34,68.03 276.34,65.49 265.16,54.32 263.64,54.32 256.02,46.7 249.92,46.7 231.12,27.9 229.6,27.9 227.57,25.87 D12.S2
  Bottom 0.254: D12.S2 226.55,26.38 224.52,28.41 224.01,28.41 D12.R2
!77  (via drill 0.61)
  Top 0.254: D12.T2 224.01,22.31 226.55,19.77 D12.U2
  Route2 0.254: v287,84.8 287,83.78 280.4,77.18 279.89,77.18 272.78,70.07 272.78,69.56 256.53,53.3 252.46,53.3 225.54,26.38 225.54,24.85 224.01,23.33 D12.T2
  Bottom 0.254: v287,84.8 301.74,84.8 302.75,85.81 C06.V2
!ADDR_ACC  (via drill 0.61)
  Top 0.254: v203.19,141.19 203.19,165.06 203.69,165.57 v203.69,167.09
  Route2 0.254: v203.19,141.19 196.58,134.58 196.58,130.01 185.91,119.34 181.85,119.34 164.58,102.07 164.07,102.07 C17.P1
  Route15 0.254: v203.69,167.09 206.23,167.09 217.92,155.41 217.92,153.89 218.93,152.87 218.93,151.85 v221.98,148.81
  Bottom 0.254: v221.98,148.81 223,147.79 233.67,147.79 234.68,146.77 240.78,146.77 242.3,148.3 244.33,148.3 246.87,150.84 256.53,150.84 257.54,149.82 260.08,149.82 261.61,151.35 273.29,151.35 277.35,155.41 B08.T2
!B-BRK  (via drill 0.61)
  Top 0.254: v357.11,144.23 358.63,145.76 358.63,154.39 357.62,155.41 B02.T2
  Route2 0.254: B02.J1 363.71,180.81 363.71,177.25 362.19,175.73 362.19,173.7 360.67,172.17 B02.M2 | B02.C1 366.25,197.07 364.22,197.07 359.14,191.99 359.14,190.46 357.11,188.43 B02.F2 | B02.P1 366.25,165.57 364.73,165.57 359.14,159.98 359.14,157.95 357.62,156.43 B02.T2
  Route15 0.254: B02.M2 360.67,171.67 362.7,171.67 364.73,169.63 364.73,168.11 366.76,166.08 B02.P1 | B02.F2 357.62,187.41 359.65,187.41 361.68,185.38 361.68,183.35 363.21,181.83 B02.J1 | v253.48,144.23 249.41,148.3 249.41,148.81 B10.V2
  Bottom 0.254: v253.48,144.23 253.99,143.73 346.44,143.73 346.95,143.22 356.09,143.22 v357.11,144.23
!BAC_00  (via drill 0.61)
  Route2 0.254: v331.71,135.09 325.61,128.99 324.6,128.99 266.69,71.08 266.69,69.56 256.02,58.89 256.02,54.83 D10.F1 | v302.75,197.07 308.85,203.16 312.41,203.16 B06.A1
  Route15 0.254: v302.75,197.07 299.71,194.02 304.79,188.94 304.79,187.92 307.83,184.87 307.83,180.81 324.09,164.55 324.09,164.05 324.6,163.54 326.63,163.54 348.98,141.19 348.98,139.66 351.01,137.63 C03.B1
  Bottom 0.254: v331.71,135.09 332.22,135.6 349.49,135.6 350.5,136.61 C03.B1
!BAC_01  (via drill 0.61)
  Top 0.254: v257.54,81.75 257.54,52.79 258.56,51.78 D10.H1
  Route2 0.254: v321.55,81.75 325.11,81.75 341.36,98.01 341.36,99.02 353.05,110.71 353.05,111.21 356.09,114.26 356.09,114.77 v360.16,118.83
  Route15 0.254: v360.16,118.83 360.16,119.34 356.09,123.41 356.09,124.93 354.06,126.96 C03.E1 354.06,127.98 354.06,131.53 352.03,133.57 352.03,137.63 349.49,140.17 349.49,141.69 348.47,142.71 348.47,144.74 344.92,148.3 343.9,148.3 343.39,148.81 343.39,151.35 342.88,151.85 342.88,153.38 332.73,163.54 332.22,163.54 327.65,168.11 327.65,171.16 322.06,176.75 318.5,176.75 310.88,184.37 310.88,187.92 309.87,188.94 309.87,193.51 B06.D1
  Bottom 0.254: v257.54,81.75 317.49,81.75 317.99,82.26 321.04,82.26 v321.55,81.75
!BAC_02  (via drill 0.61)
  Route2 0.254: v280.4,76.16 255.51,51.27 255.51,48.73 D10.J1 | v318.5,81.24 318.5,84.29 325.11,90.89 326.12,90.89 352.03,116.8 352.03,118.33 354.57,120.87 C03.H1 | v301.74,177.76 309.36,185.38 309.36,186.91 B06.F1
  Route15 0.254: v301.74,177.76 301.74,174.21 305.8,170.14 306.31,170.14 308.34,168.11 308.34,167.6 314.94,161 315.96,161 317.49,159.47 317.49,157.95 324.09,151.35 326.63,151.35 342.38,135.6 342.38,130.52 350,122.9 352.03,122.9 353.55,121.37 C03.H1
  Bottom 0.254: v280.4,76.16 285.48,81.24 v318.5,81.24
!BAC_03  (via drill 0.61)
  Top 0.254: v353.05,87.34 352.54,87.85 352.54,113.25 353.55,114.26 C03.K1 | v281.93,150.84 282.43,150.33 282.43,124.93 282.94,124.42 282.94,121.88 282.43,121.37 282.43,69.05 v280.4,67.02
  Route2 0.254: 267.19,46.19 269.73,46.19 270.24,46.7 272.27,46.7 v312.91,87.34 | 267.19,46.19 264.15,46.19 263.13,45.17 259.06,45.17 D10.K1 | v281.93,150.84 289.04,157.95 289.04,162.52 307.32,180.81 309.36,180.81 B06.J1 | v280.4,67.02 279.38,67.02 271.26,58.89 270.75,58.89 267.19,55.33 267.19,46.19
  Bottom 0.254: v312.91,87.34 317.49,87.34 318.5,86.32 320.03,86.32 321.04,87.34 v353.05,87.34
!BAC_04  (via drill 0.61)
  Route2 0.254: v293.61,53.3 299.71,53.3 317.99,71.59 321.55,71.59 347.46,97.5 347.97,97.5 349.49,99.02 349.49,99.53 351.01,101.05 351.52,101.05 352.54,102.07 352.54,102.58 357.11,107.15 | 357.11,107.15 v357.62,107.15 | v376.41,128.49 376.41,126.45 357.11,107.15
  Route15 0.254: v357.62,107.15 355.59,107.15 354.57,108.17 C03.M1 | v331.71,172.68 366.76,137.63 367.27,137.63 371.33,133.57 371.33,133.06 375.91,128.49 v376.41,128.49
  Bottom 0.254: v293.61,53.3 280.91,53.3 274.31,46.7 254.49,46.7 252.97,45.17 D10.K2 | v331.71,172.68 331.2,173.19 322.56,173.19 322.06,173.7 310.37,173.7 309.87,174.21 B06.L1
!BAC_05  (via drill 0.61)
  Top 0.254: v340.85,111.72 341.87,112.74 341.87,113.25 342.38,113.75 342.38,137.12 v339.84,139.66
  Route15 0.254: v340.85,111.72 349.49,103.09 351.52,103.09 352.54,102.07 353.55,102.07 C03.P1 | v339.84,139.66 330.69,148.81 330.69,149.82 315.45,165.06 314.94,165.06 313.42,166.59 311.39,166.59 309.87,168.11 B06.N1
!BAC_06  (via drill 0.61)
  Route2 0.254: v309.87,140.17 309.87,144.23 v312.41,146.77
  Route15 0.254: v309.87,140.17 330.69,119.34 332.22,119.34 339.84,111.72 339.84,107.66 351.52,95.97 353.55,95.97 C03.S1 | v312.41,146.77 312.41,150.84 311.39,151.85 311.39,159.98 309.87,161.51 B06.R1
!BAC_07  (via drill 0.61)
  Route15 0.254: v297.67,144.74 327.65,114.77 327.65,113.25 351.52,89.37 353.55,89.37 C03.U1
  Bottom 0.254: v297.67,144.74 298.18,144.23 306.31,144.23 307.83,145.76 307.83,148.81 309.36,148.81 B06.V1
!BAC_08  (via drill 0.61)
  Route2 0.254: v351.01,157.95 353.05,155.92 341.36,144.23 341.36,142.71 337.81,139.15 v337.81,138.65
  Route15 0.254: v351.01,157.95 339.84,169.13 339.84,170.14 326.63,183.35 326.63,184.87 314.94,196.56 312.91,196.56 B06.C1 | v337.81,138.65 335.77,136.61 v340.85,131.53
  Bottom 0.254: v340.85,131.53 343.9,128.49 343.9,124.93 C03.F2
!BAC_09  (via drill 0.61)
  Route2 0.254: v353.05,125.95 352.03,124.93 352.03,123.41 351.01,122.39 350,122.39 348.98,121.37 348.98,120.36 346.95,118.33 344.92,118.33 C03.J2 | v289.04,171.67 289.55,171.67 304.28,186.4 304.28,188.94 305.8,190.46 B06.E2
  Route15 0.254: v353.05,125.95 353.05,126.45 349.49,130.01 349.49,135.09 v329.68,154.9 | v306.82,154.39 306.31,154.39 v289.04,171.67
  Bottom 0.254: v329.68,154.9 329.17,154.39 v306.82,154.39
!BAC_10  (via drill 0.61)
  Top 0.254: v254.49,241.77 253.99,242.28 253.99,254.98 250.94,258.03 250.94,262.09 249.41,263.61 A10.D2
  Route2 0.254: v338.31,107.66 342.38,111.72 343.9,111.72 C03.L2 | v277.86,159.98 278.88,159.98 301.23,182.33 303.77,182.33 305.8,184.37 B06.H2
  Route15 0.254: v254.49,241.77 272.78,223.48 272.78,222.47 291.58,203.67 291.58,202.15 298.69,195.03 298.69,194.02 304.28,188.43 304.28,186.91 306.31,184.87 B06.H2 | v328.66,108.67 327.14,108.67 305.8,130.01 305.8,131.03 282.94,153.89 282.94,154.9 v277.86,159.98
  Bottom 0.254: v338.31,107.66 337.81,107.15 330.19,107.15 v328.66,108.67
!BAC_11  (via drill 0.61)
  Top 0.254: v236.71,115.79 236.71,113.75 235.7,112.74 235.19,112.74 235.19,104.1 236.71,102.58 236.71,99.53 C11.R2
  Route2 0.254: v326.12,84.29 326.12,87.85 326.63,88.35 326.63,89.37 340.85,103.59 342.38,103.59 343.9,105.12 C03.N2 | v300.72,179.79 299.71,179.79 298.69,178.78 298.69,174.21 273.29,148.81 273.29,148.3 272.78,147.79 271.26,147.79 265.16,141.69 264.65,141.69 243.83,120.87 242.81,120.87 239.25,117.31 238.24,117.31 v236.71,115.79
  Route15 0.254: v249.41,83.78 236.71,96.48 236.71,98.51 C11.R2
  Bottom 0.254: v249.41,83.78 325.61,83.78 v326.12,84.29 | v300.72,179.79 304.28,179.79 305.8,178.27 B06.K2
!BLK_IN_SYNC  (via drill 0.61)
  Top 0.254: v216.9,78.19 215.89,79.21 215.89,97.5 214.87,98.51 C13.R1 | v136.64,212.31 139.18,209.77 139.18,119.34 136.64,116.8 v136.64,88.35
  Route2 0.254: v204.71,276.31 198.61,276.31 168.64,246.34 168.64,244.31 v136.64,212.31
  Route15 0.254: v216.9,78.19 246.87,48.22 248.91,48.22 D10.J2
  Bottom 0.254: v204.71,276.31 256.02,276.31 258.56,273.77 A10.A1 | v136.64,88.35 146.8,78.19 v216.9,78.19
!BMB_00
  Bottom 0.254: C06.A1 312.91,139.66 313.93,138.65 320.03,138.65 321.04,139.66 323.58,139.66 325.61,137.63 330.19,137.63 331.2,138.65 336.28,138.65 337.3,139.66 338.31,139.66 339.84,138.14 362.7,138.14 363.21,137.63 C02.B1
!BMB_01  (via drill 0.61)
  Top 0.254: v364.73,146.27 364.73,139.15 365.24,138.65 365.24,128.99 366.25,127.98 C02.E1
  Route2 0.254: v322.06,145.25 309.87,133.06 309.87,131.03 C06.D1
  Bottom 0.254: v322.06,145.25 323.07,146.27 v364.73,146.27
!BMB_02  (via drill 0.61)
  Route15 0.254: v340.35,130.01 341.87,130.01 v350.5,121.37
  Bottom 0.254: v340.35,130.01 336.28,125.95 316.47,125.95 315.96,125.44 310.37,125.44 309.87,124.93 C06.F1 | v350.5,121.37 351.52,122.39 365.24,122.39 366.25,121.37 C02.H1
!BMB_03  (via drill 0.61)
  Route15 0.254: v331.71,115.79 v338.31,109.18
  Bottom 0.254: v331.71,115.79 331.2,116.29 320.53,116.29 320.03,116.8 310.37,116.8 309.87,117.31 C06.J1 | v338.31,109.18 338.82,109.69 364.22,109.69 365.75,111.21 365.75,114.26 366.25,114.26 C02.K1
!BMB_04  (via drill 0.61)
  Route15 0.254: v328.66,103.09 327.65,104.1 321.55,104.1 320.53,105.12 318.5,105.12 315.96,107.66 314.44,107.66 313.93,108.17 313.93,109.18 311.9,111.21 309.87,111.21 C06.L1
  Bottom 0.254: v328.66,103.09 329.17,103.59 359.65,103.59 364.22,108.17 366.25,108.17 C02.M1
!BMB_05
  Bottom 0.254: C06.N1 309.87,104.61 310.88,103.59 313.93,103.59 316.98,100.55 365.24,100.55 366.25,101.56 C02.P1
!BMB_06
  Bottom 0.254: C06.R1 309.87,98.51 310.88,97.5 355.59,97.5 358.63,94.45 365.24,94.45 366.25,95.47 C02.S1
!BMB_07
  Bottom 0.254: C06.V1 309.87,85.81 310.88,84.8 325.11,84.8 326.12,85.81 329.68,85.81 332.22,83.27 358.12,83.27 363.71,88.86 366.25,88.86 C02.U1
!BMB_08  (via drill 0.61)
  Route15 0.254: v326.12,132.04 v335.26,122.9
  Bottom 0.254: v326.12,132.04 314.44,132.04 312.91,133.57 C06.C1 | v335.26,122.9 355.59,122.9 356.6,123.91 C02.F2
!BMB_09  (via drill 0.61)
  Route15 0.254: v315.96,115.79 307.32,124.42 307.32,125.44 306.31,126.45 306.31,126.96 C06.E2 | v357.11,114.26 357.11,117.31 C02.J2
  Bottom 0.254: v315.96,115.79 319.01,112.74 345.93,112.74 346.44,112.23 348.98,112.23 350,113.25 356.09,113.25 v357.11,114.26
!BMB_10  (via drill 0.61)
  Route15 0.254: v324.09,119.85 325.61,119.85 v335.26,110.2
  Bottom 0.254: v324.09,119.85 307.83,119.85 306.82,120.87 C06.H2 | v335.26,110.2 352.03,110.2 353.55,111.72 356.6,111.72 C02.L2
!BMB_11  (via drill 0.61)
  Route15 0.254: v315.45,103.59 306.31,112.74 306.31,114.26 C06.K2
  Bottom 0.254: v315.45,103.59 315.96,104.1 356.09,104.1 356.6,104.61 C02.N2
!BMR00  (via drill 0.61)
  Route15 0.254: v164.58,161 107.68,217.89 107.68,220.43 85.33,242.79 85.33,248.88 84.31,249.9 84.31,253.96 A23.H1
  Bottom 0.254: v164.58,161 165.09,160.49 194.04,160.49 195.06,161.51 B14.R2
!BMR01
  Route15 0.254: A23.A1 84.31,273.77 87.87,273.77 105.14,291.05 162.04,234.15 164.07,234.15 197.09,201.13 197.6,201.13 198.11,200.62 198.11,199.61 202.68,195.03 202.68,192.49 204.2,190.97 B14.E1
!C00  (via drill 0.61)
  Top 0.254: v223,191.99 222.49,192.49 222.49,201.64 228.08,207.23 228.08,234.66 227.57,235.17 A12.P2
  Route2 0.254: v217.41,149.82 185.91,118.33 182.87,118.33 C15.J2 | B13.S2 211.31,159.47 211.31,161 213.85,163.54 215.38,163.54 216.9,165.06 B13.P1
  Route15 0.254: v217.41,149.82 217.41,152.36 B13.U1 217.41,152.87 217.41,154.9 215.38,156.93 212.84,156.93 211.31,158.46 B13.S2 | B15.H1 192.52,183.86 194.55,183.86 203.69,174.71 206.23,174.71 207.25,173.7 210.81,173.7 215.38,169.13 215.38,167.09 216.9,165.57 B13.P1
  Bottom 0.254: v223,191.99 202.17,191.99 195.06,184.87 192.52,184.87 B15.H1
!C01  (via drill 0.61)
  Top 0.254: 209.79,164.05 208.27,162.52 B13.R2 | 209.79,164.05 209.79,170.14 210.81,171.16 B13.M2 211.31,172.17 212.33,173.19 v212.33,219.93 | v215.38,132.04 215.38,154.39 215.89,154.9 215.89,157.44 214.87,158.46 214.87,160.49 215.38,161 215.38,163.03 214.36,164.05 209.79,164.05 | v227.06,85.81 225.54,87.34 225.54,110.71 226.55,111.72 226.55,112.74 225.03,114.26 225.03,122.9 224.01,123.91 C12.F2
  Route2 0.254: v212.33,219.93 224.01,231.61 A12.R2
  Route15 0.254: v215.38,132.04 223,124.42 C12.F2 | v227.06,85.81 227.57,85.81 252.46,60.92 255,60.92 D10.D1
  Bottom 0.254: B10.P1 258.56,165.57 258.56,169.63 212.84,169.63 211.31,171.16 B13.M2
!CK00  (via drill 0.61)
  Top 0.254: v196.07,178.27 196.58,177.76 196.58,156.93 195.57,155.92 B14.T2
  Route15 0.254: v196.07,178.27 195.57,178.27 155.43,218.4 155.43,220.43 141.72,234.15 141.72,238.21 A18.N2
  Bottom 0.254: B14.T2 195.57,155.41 197.09,153.89 203.19,153.89 204.2,152.87 B14.U1
!CK01  (via drill 0.61)
  Top 0.254: v174.23,125.95 174.23,96.99 173.21,95.97 C16.S2
  Route2 0.254: C16.S2 172.71,95.47 170.17,92.93 C16.T2 | v174.23,125.95 185.91,137.63 186.93,137.63 198.61,149.31 201.15,149.31 B14.V1
  Bottom 0.254: C16.T2 170.17,91.91 172.2,89.88 172.71,89.88 C16.U2
!CLR_DF  (via drill 0.61)
  Top 0.254: v177.28,34 174.23,34 174.23,91.91 171.18,94.96 171.18,107.66 168.64,110.2 v168.64,152.87 | v245.86,211.29 245.86,222.47 A11.U1
  Route2 0.254: v168.64,152.87 169.15,152.87 195.57,179.29 196.58,179.29 228.59,211.29 v229.09,211.29
  Bottom 0.254: v177.28,34 208.77,34 211.31,36.54 235.7,36.54 236.21,36.03 D11.N2 | v229.09,211.29 v245.86,211.29
!CLR_DTF
  Top 0.254: D11.U2 239.25,19.77 234.68,19.77 234.68,21.81 219.44,37.05 219.44,85.31 217.92,86.83 217.92,88.86 C13.U1
!CSTA  (via drill 0.61)
  Top 0.254: v277.86,172.68 276.34,174.21 v276.34,187.92 | v247.89,195.03 244.84,195.03 244.84,230.09 248.4,233.64 248.4,237.71 247.89,238.21 247.89,243.8 248.91,244.82 A10.L2
  Route15 0.254: v277.86,172.68 281.42,172.68 297.17,156.93 298.18,156.93 305.8,149.31 305.8,146.77 311.39,141.19 311.39,139.66 322.56,128.49 323.58,129.5 323.58,131.53 322.56,132.55 325.11,135.09 327.65,135.09 330.69,132.04 332.22,132.04 333.23,131.03 337.81,131.03 C04.D1
  Bottom 0.254: v276.34,187.92 269.73,187.92 262.62,195.03 v247.89,195.03
!DATA  (via drill 0.61)
  Top 0.254: v216.39,153.89 216.39,121.88 216.9,121.37 C13.H1
  Route2 0.254: v216.39,153.89 223.51,161 224.52,161 229.6,166.08 229.6,168.11 B12.N1
  Route15 0.254: v232.14,112.23 231.12,112.23 230.62,112.74 226.55,112.74 217.92,121.37 C13.H1
  Bottom 0.254: C16.D2 170.17,130.01 170.17,125.44 171.18,125.44 171.69,124.93 171.69,119.85 215.89,119.85 216.9,120.87 C13.H1 | v232.14,112.23 236.21,112.23 C11.L2
!DB_00  (via drill 0.61)
  Top 0.254: v372.86,72.1 377.94,77.18 377.94,103.59 380.99,106.64 380.99,124.42 v380.48,124.93
  Route2 0.254: v370.32,147.28 370.32,148.3 371.33,149.31 371.33,153.38 378.95,161 378.95,163.54 380.48,165.06 380.48,167.6 382.51,169.63 382.51,170.65 v383.02,171.16
  Route15 0.254: v380.48,124.93 380.48,126.45 384.03,130.01 384.03,133.57 v370.32,147.28 | v383.02,171.16 383.02,172.17 377.43,177.76 | 377.43,177.76 365.24,189.95 365.24,191.99 363.71,193.51 B02.D1 | 377.43,177.76 377.43,188.43 374.89,190.97 374.89,192.49 327.14,240.25 327.14,243.29 310.88,259.55 310.88,264.63 309.36,266.15 309.36,269.71 A06.B1
  Bottom 0.254: v372.86,72.1 309.87,72.1 309.87,67.53 D06.B1
!DB_01  (via drill 0.61)
  Top 0.254: 310.88,205.7 310.88,262.6 309.87,263.61 A06.D1 | 310.88,205.7 310.88,62.45 309.87,61.43 D06.D1 | v310.37,205.7 310.88,205.7
  Bottom 0.254: v310.37,205.7 310.88,206.21 374.38,206.21 374.38,196.05 370.82,192.49 368.29,192.49 367.27,191.48 B02.E1
!DB_02  (via drill 0.61)
  Top 0.254: 311.39,233.13 311.39,259.55 312.41,260.57 A06.E1 | 311.39,233.13 311.39,58.89 312.41,57.87 D06.E1 | v312.41,233.13 311.39,233.13
  Route15 0.254: v312.41,233.13 339.84,205.7 339.84,203.16 345.93,197.07 345.93,196.05 363.71,178.27 366.25,178.27 B02.K1
!DB_03  (via drill 0.61)
  Top 0.254: v374.89,119.85 v374.89,80.23
  Route2 0.254: v337.81,78.7 312.91,53.81 312.91,51.78 D06.H1 | v374.89,119.85 375.91,120.87 375.91,121.88 377.43,123.41 377.43,126.96 377.94,127.47 377.94,130.01 380.48,132.55 380.48,137.12 v383.02,139.66 | v373.37,188.43 373.37,187.41 365.24,179.29 365.24,177.25 363.71,175.73 B02.L1
  Route15 0.254: v383.02,139.66 383.02,151.85 386.06,154.9 367.78,173.19 365.24,173.19 363.71,174.71 B02.L1 | v373.37,188.43 371.33,190.46 371.33,195.03 326.12,240.25 324.6,240.25 312.91,251.93 312.91,253.96 A06.H1
  Bottom 0.254: v337.81,78.7 339.33,80.23 v374.89,80.23
!DB_04  (via drill 0.61)
  Top 0.254: 308.34,147.28 308.34,249.9 309.36,250.91 A06.J1 | 308.34,147.28 308.34,49.75 309.36,48.73 D06.J1 | v308.85,147.28 308.34,147.28
  Bottom 0.254: v308.85,147.28 309.36,147.79 336.28,147.79 336.28,163.03 337.3,164.05 362.19,164.05 363.21,163.03 B02.R1
!DB_05  (via drill 0.61)
  Top 0.254: v370.82,71.08 368.79,73.11 368.79,121.37 v369.81,122.39
  Route2 0.254: v369.81,122.39 374.38,126.96 374.38,133.06 v382,140.68
  Route15 0.254: v382,140.68 382,145.76 370.32,157.44 | 370.32,157.44 368.79,157.44 367.27,158.97 B02.S1 | v326.63,212.81 326.63,209.77 340.35,196.05 344.41,196.05 352.03,188.43 352.03,183.35 355.59,179.79 355.59,178.78 358.63,175.73 358.63,171.16 370.32,159.47 370.32,157.44
  Bottom 0.254: v370.82,71.08 371.33,71.08 371.33,66.51 367.27,62.45 356.09,62.45 350,56.35 321.04,56.35 311.39,46.7 309.87,46.7 309.87,42.13 D06.L1 | v326.63,212.81 326.63,230.59 316.98,240.25 309.87,240.25 309.87,244.31 A06.L1
!DB_06  (via drill 0.61)
  Top 0.254: v383.53,115.28 384.03,115.79 384.03,127.47 385.05,128.49 385.05,172.68 v383.02,174.71
  Route2 0.254: v383.53,115.28 383.02,115.28 375.4,107.66 375.4,107.15 340.85,72.61 340.35,72.61 326.63,58.89 326.63,56.86 318.5,48.73 318.5,48.22 312.91,42.63 312.91,39.08 D06.M1
  Route15 0.254: A06.M1 312.91,241.26 312.91,237.71 326.63,223.99 326.63,220.94 343.39,204.18 343.9,204.18 348.98,199.1 348.98,194.02 356.6,186.4 358.63,186.4 360.16,184.87 B02.H2
  Bottom 0.254: v383.02,174.71 380.99,176.75 371.84,176.75 364.22,184.37 360.67,184.37 B02.H2
!DB_07  (via drill 0.61)
  Top 0.254: 313.93,179.79 313.93,234.15 312.91,235.17 A06.P1 | 313.93,179.79 313.93,151.35 313.42,150.84 313.42,144.74 313.93,144.23 313.93,33.49 312.91,32.47 D06.P1 | v313.42,179.79 313.93,179.79
  Bottom 0.254: v313.42,179.79 313.93,179.29 328.66,179.29 329.17,179.79 355.59,179.79 356.6,180.81 B02.J2
!DB_08  (via drill 0.61)
  Top 0.254: v382.51,93.43 382,93.94 382,101.56 382.51,102.07 382.51,119.34 382,119.85 382,120.87 383.53,122.39 383.53,138.65 384.03,139.15 v384.03,167.6
  Route2 0.254: v382.51,93.43 380.48,91.4 380.48,88.35 347.97,55.84 347.97,54.83 326.63,33.49 326.63,31.46 315.45,20.28 312.91,22.82 312.91,25.36 D06.S1 | v354.06,174.21 358.12,170.14 357.11,169.13 B02.N2
  Route15 0.254: v354.06,174.21 342.88,185.38 342.88,186.91 333.23,196.56 333.23,201.13 318.5,215.86 317.49,215.86 316.98,216.37 316.98,220.43 315.96,221.45 315.96,223.48 312.91,226.53 312.91,228.56 A06.S1
  Bottom 0.254: v384.03,167.6 358.12,167.6 357.62,168.11 B02.N2
!DB_09  (via drill 0.61)
  Route2 0.254: v338.31,69.05 338.31,69.56 340.85,72.1 341.36,72.1 356.6,87.34 359.14,87.34 359.65,87.85 361.17,87.85 380.48,107.15 380.48,110.71 386.57,116.8 386.57,121.88 v385.56,122.9 | v366.25,186.91 366.25,186.4 359.14,179.29 359.14,167.09 360.16,166.08 B02.P2
  Route15 0.254: v366.25,186.91 355.59,197.57 355.59,199.61 326.63,228.56 326.63,230.09 304.79,251.93 304.79,258.03 303.26,259.55 303.26,263.61 A06.D2
  Bottom 0.254: v338.31,69.05 327.65,69.05 321.04,62.45 304.79,62.45 303.77,61.43 D06.D2 | v385.56,122.9 386.57,123.91 386.57,160.49 367.78,160.49 363.21,165.06 360.67,165.06 B02.P2
!DB_10  (via drill 0.61)
  Top 0.254: 307.83,212.31 307.83,259.55 306.82,260.57 A06.E2 | 307.83,212.31 307.83,58.89 306.82,57.87 D06.E2 | v307.32,212.31 307.83,212.31
  Route15 0.254: v307.32,212.31 314.94,204.69 320.03,204.69 330.69,194.02 330.69,186.91 341.36,176.24 345.43,176.24 349.49,172.17 349.49,167.6 362.19,154.9 360.67,153.38 B02.U2
!DB_11  (via drill 0.61)
  Top 0.254: v372.86,82.26 374.38,83.78 374.38,117.31 v373.87,117.82 | v374.38,194.53 374.89,194.02 374.89,136.11 v376.92,134.07
  Route2 0.254: v333.23,81.75 306.31,54.83 306.31,51.78 D06.H2
  Route15 0.254: v376.92,134.07 366.25,144.74 362.19,144.74 357.62,149.31 B02.V2 | v321.55,252.95 323.07,252.95 326.63,249.39 326.63,247.36 352.54,221.45 352.54,220.43 374.38,198.59 v374.38,194.53
  Bottom 0.254: v333.23,81.75 333.74,82.26 v372.86,82.26 | v373.87,117.82 371.84,119.85 371.84,125.95 373.87,125.95 374.89,126.96 374.89,134.07 v376.92,134.07 | v321.55,252.95 307.83,252.95 306.82,253.96 A06.H2
!DF  (via drill 0.61)
  Route2 0.254: v147.81,127.98 162.04,142.2 163.05,142.2 168.64,147.79 171.69,147.79 175.25,151.35 176.26,151.35 184.9,159.98 188.96,159.98 202.68,173.7 202.68,174.21 203.19,174.71 205.73,174.71 207.25,176.24 217.92,176.24 222.49,180.81 222.49,181.83 226.05,185.38 227.57,185.38 229.09,183.86 | 229.09,183.86 230.62,182.33 229.6,181.32 B12.J1 | v299.2,233.64 280.91,233.64 271.26,223.99 270.75,223.99 257.03,210.27 257.03,209.77 256.53,209.26 254.49,209.26 229.09,183.86
  Route15 0.254: v147.81,127.98 168.64,107.15 168.64,104.1 223.51,49.24 225.03,49.24 239.25,35.01 239.25,32.47 D11.P2 | v299.2,233.64 299.2,233.13 316.98,215.35 317.49,215.35 325.11,207.73 325.11,203.67 B05.A1
!DTB_00  (via drill 0.61)
  Route2 0.254: v246.87,147.79 247.89,148.81 247.89,150.33 254.49,156.93 258.56,156.93 263.13,161.51 263.13,165.06 270.75,172.68 273.8,172.68 287,185.89 v287.51,185.89
  Route15 0.254: v246.87,147.79 248.4,146.27 248.4,144.23 250.94,141.69 250.94,139.66 258.56,132.04 262.62,132.04 263.13,131.53 263.13,131.03 268.21,125.95 268.21,124.93 C09.F1
  Bottom 0.254: v287.51,185.89 287.51,189.45 288.53,189.45 288.53,192.49 314.94,192.49 317.99,189.45 337.81,189.45 340.85,192.49 358.12,192.49 366.25,200.62 366.25,203.16 B02.A1
!DTB_01  (via drill 0.61)
  Top 0.254: v367.27,154.9 367.78,155.41 367.78,194.53 v366.76,195.54
  Route15 0.254: v297.67,75.65 272.78,100.55 272.78,103.09 262.11,113.75 262.11,117.31 C09.J2 | v385.56,121.37 384.54,122.39 384.54,136.61 380.99,140.17 380.99,141.19 v367.27,154.9 | v366.76,195.54 366.25,195.54 365.24,196.56 365.24,198.59 363.71,200.11 B02.B1
  Bottom 0.254: v297.67,75.65 298.18,75.15 376.92,75.15 386.57,84.8 386.57,121.37 v385.56,121.37
!DTB_02  (via drill 0.61)
  Route15 0.254: v306.82,78.19 290.56,94.45 286.5,94.45 278.37,102.58 276.85,102.58 271.76,107.66 271.76,108.17 C09.M1 | v385.05,84.8 385.05,90.39 386.57,91.91 386.57,163.54 383.02,167.09 383.02,169.63 382,170.65 382,171.67 367.78,185.89 365.24,185.89 363.71,187.41 B02.F1
  Bottom 0.254: v306.82,78.19 307.32,77.69 377.94,77.69 v385.05,84.8
!DTB_03  (via drill 0.61)
  Top 0.254: v372.35,129.5 371.84,130.01 371.84,168.11 374.38,170.65 374.38,173.19 v373.87,173.7
  Route2 0.254: v366.76,119.34 367.27,119.34 367.78,119.85 367.78,126.45 368.29,126.96 369.81,126.96 v372.35,129.5
  Route15 0.254: v284.47,82.77 272.78,94.45 270.75,94.45 266.69,98.51 262.11,98.51 C09.R2 | v383.02,99.53 384.54,101.05 377.94,107.66 377.43,107.66 371.84,113.25 371.84,114.26 v366.76,119.34 | v373.87,173.7 373.87,175.22 368.79,180.3 368.79,182.84 367.27,184.37 B02.H1
  Bottom 0.254: v284.47,82.77 327.14,82.77 329.17,80.73 373.87,80.73 374.38,81.24 375.4,81.24 375.91,80.73 375.91,79.72 377.43,79.72 377.94,80.23 377.94,99.53 v383.02,99.53
!DTB_04  (via drill 0.61)
  Route2 0.254: v326.63,73.62 329.68,73.62 365.75,109.69 369.81,109.69 377.43,117.31 377.43,122.39 377.94,122.9 377.94,124.42 380.48,126.96 380.48,131.53 380.99,132.04 380.99,136.11 384.03,139.15 384.03,152.36 v383.02,153.38
  Route15 0.254: v291.07,74.64 276.85,88.86 271.76,88.86 C09.U1 | v383.02,153.38 368.79,167.6 368.79,170.14 367.27,171.67 B02.M1
  Bottom 0.254: v291.07,74.64 292.09,73.62 v326.63,73.62
!DTB_05  (via drill 0.61)
  Top 0.254: v322.06,115.28 323.58,116.8 323.58,118.83 323.07,119.34 323.07,122.9 324.09,123.91 v324.09,137.63
  Route2 0.254: v288.02,87.85 289.04,87.85 311.39,110.2 316.98,110.2 v322.06,115.28 | v324.09,137.63 324.09,140.68 325.11,141.69 327.65,141.69 342.88,156.93 342.88,157.44 346.44,161 346.44,162.52 348.98,165.06 348.98,169.13 v350.5,170.65
  Bottom 0.254: v288.02,87.85 284.97,84.8 269.73,84.8 268.72,85.81 C09.V1 | v350.5,170.65 351.01,170.14 362.19,170.14 363.21,169.13 B02.N1
!DTB_06  (via drill 0.61)
  Route2 0.254: v285.99,206.21 271.76,191.99 270.75,191.99 268.72,189.95 268.72,187.92 B09.F1
  Route15 0.254: v342.88,209.77 343.9,209.77 355.08,198.59 355.08,196.56 357.11,194.53 B02.D2
  Bottom 0.254: v285.99,206.21 289.55,209.77 v342.88,209.77
!DTB_07  (via drill 0.61)
  Route2 0.254: v335.26,213.83 326.12,204.69 317.99,204.69 308.34,195.03 302.25,195.03 301.23,194.02 300.21,194.02 291.58,185.38 291.58,180.3 287,175.73 287,173.19 278.88,165.06 278.88,161.51 278.37,161 275.83,161 275.32,160.49 275.32,159.98 272.78,157.44 272.78,151.85 270.75,149.82 268.72,149.82 B09.V1
  Route15 0.254: v335.26,213.83 356.09,193 358.63,193 360.16,191.48 B02.E2
!DTB_08  (via drill 0.61)
  Route2 0.254: v334.76,164.05 337.3,164.05 v341.87,168.62
  Bottom 0.254: v334.76,164.05 324.09,164.05 317.99,170.14 272.78,170.14 271.76,171.16 B09.M1 | v341.87,168.62 346.95,173.7 352.03,173.7 356.09,177.76 360.16,177.76 B02.K2
!DTB_09  (via drill 0.61)
  Route2 0.254: v322.56,213.32 313.93,204.69 304.79,204.69 273.29,173.19 270.24,173.19 262.11,165.06 262.11,162.52 B09.R2
  Route15 0.254: v322.56,213.32 322.56,212.81 336.28,199.1 336.28,198.08 355.08,179.29 355.08,177.76 357.11,175.73 B02.L2
!DTB_10  (via drill 0.61)
  Route2 0.254: v285.99,173.7 272.78,160.49 272.78,158.46 271.76,157.44 271.76,152.87 B09.U1
  Route15 0.254: v341.87,161 v331.71,171.16
  Bottom 0.254: v285.99,173.7 304.79,173.7 305.29,174.21 307.83,174.21 308.85,173.19 321.55,173.19 322.06,172.68 330.19,172.68 v331.71,171.16 | v341.87,161 355.59,161 356.6,162.01 B02.R2
!DTB_11  (via drill 0.61)
  Route2 0.254: v338.31,184.87 337.3,184.87 329.68,177.25 329.17,177.25 324.09,172.17 324.09,168.11 313.42,157.44 v309.87,157.44
  Route15 0.254: v338.31,184.87 338.31,184.37 360.16,162.52 360.16,159.47 B02.S2 | v309.87,157.44 v287.51,179.79
  Bottom 0.254: v287.51,179.79 263.13,179.79 262.11,180.81 B09.J2
!DTF  (via drill 0.61)
  Top 0.254: v331.2,207.23 333.23,205.19 333.23,176.75 332.22,175.73 B04.L2
  Route2 0.254: v135.62,114.77 135.62,116.29 142.73,123.41 142.73,142.71 164.58,164.55 164.58,166.08 197.09,198.59 v197.6,198.59
  Route15 0.254: v135.62,114.77 178.8,71.59 180.33,71.59 222.49,29.43 222.49,28.41 234.17,16.73 236.21,16.73 D11.V2
  Bottom 0.254: 234.68,198.59 235.19,199.1 239.76,199.1 242.81,202.15 248.4,202.15 250.94,204.69 307.83,204.69 310.37,207.23 v331.2,207.23 | 234.68,198.59 233.67,197.57 B12.C1 | 234.68,198.59 v197.6,198.59
!EA_00  (via drill 0.61)
  Top 0.254: 304.28,160.49 304.28,213.83 303.77,214.34 303.77,218.91 A06.V2 | 304.28,160.49 304.28,79.72 301.74,77.18 301.74,17.74 302.75,16.73 D06.V2 | 304.28,160.49 v303.77,160.49
  Bottom 0.254: v303.77,160.49 321.04,160.49 322.06,161.51 B05.R1
!EA_01  (via drill 0.61)
  Top 0.254: v325.61,148.81 326.63,149.82 326.63,157.44 325.61,158.46 B05.S1
  Route2 0.254: v267.7,90.89 268.72,90.89 272.78,94.96 272.78,97.5 293.1,117.82 294.62,117.82 302.25,125.44 306.31,125.44 320.53,139.66 320.53,142.2 323.07,144.74 323.07,146.27 v325.61,148.81 | v284.47,206.21 295.64,217.39 295.64,220.43 296.66,221.45 301.23,221.45 302.75,222.97 302.75,225.51 A06.T2
  Route15 0.254: v267.7,90.89 277.35,81.24 278.88,81.24 301.74,58.38 301.74,28.41 303.26,26.89 303.26,23.33 D06.T2 | v284.47,206.21 284.47,203.16 300.72,186.91 300.72,185.38 314.44,171.67 314.44,171.16 315.96,169.63 316.47,169.63 323.58,162.52 323.58,161 325.11,159.47 B05.S1
!EA_02  (via drill 0.61)
  Top 0.254: v321.55,138.65 321.04,138.14 321.04,90.89 323.58,88.35 323.58,21.3 308.34,21.3 308.34,23.84 306.82,25.36 D06.S2 | 314.44,182.33 v314.44,148.81 | 314.44,182.33 v315.45,183.35 | v314.94,222.97 314.44,222.47 314.44,193 315.96,191.48 315.96,189.95 314.44,188.43 314.44,182.33
  Route15 0.254: v321.55,138.65 321.55,141.69 v314.44,148.81 | v314.94,222.97 308.85,229.07 306.82,229.07 A06.S2
  Bottom 0.254: v315.45,183.35 315.96,183.86 318.5,183.86 B05.H2
!EF  (via drill 0.61)
  Top 0.254: v340.35,249.9 339.84,249.39 339.84,241.26 342.38,238.72 342.38,221.45 341.36,220.43 341.36,204.18 B04.A1
  Bottom 0.254: v340.35,249.9 339.84,249.39 247.38,249.39 246.37,248.37 A11.K1
!END  (via drill 0.61)
  Top 0.254: v289.55,191.48 288.53,192.49 288.53,250.91 284.47,254.98 284.47,257.01 A08.F1
  Route2 0.254: A09.M2 265.67,241.77 267.19,241.77 272.78,247.36 272.78,248.37 280.4,255.99 282.94,255.99 283.96,257.01 A08.F1
  Bottom 0.254: v289.55,191.48 292.09,188.94 337.3,188.94 337.81,188.43 B04.F1
!ENI  (via drill 0.61)
  Route2 0.254: v315.45,114.26 315.96,114.26 319.01,117.31 319.52,117.31 324.6,122.39 327.65,122.39 v360.16,154.9
  Route15 0.254: v360.16,154.9 360.16,155.92 348.98,167.09 348.98,168.62 346.44,171.16 346.44,173.19 344.92,174.71 B03.L2
  Bottom 0.254: v315.45,114.26 314.44,113.25 300.21,113.25 300.21,108.67 C07.M1
!FR_00  (via drill 0.61)
  Top 0.254: C12.P1 233.67,102.58 234.17,103.09 234.17,113.75 233.67,114.26 C12.K1 233.67,115.28 v233.67,118.83
  Route2 0.254: v233.67,118.83 234.17,118.83 v260.08,144.74
  Bottom 0.254: B03.N1 350.5,168.11 349.49,167.09 339.33,167.09 335.26,163.03 333.74,163.03 333.74,155.92 329.17,151.35 305.29,151.35 304.28,152.36 300.21,152.36 B07.U1 299.71,152.87 298.69,153.89 292.59,153.89 290.05,151.35 283.96,151.35 279.38,146.77 262.11,146.77 v260.08,144.74
!FR_01  (via drill 0.61)
  Top 0.254: v297.67,158.97 298.18,158.46 298.18,150.84 297.17,149.82 B07.V1 | v318.5,180.3 317.99,180.81 317.99,189.95 318.5,190.46 B05.E2
  Route2 0.254: v297.67,158.97 297.67,159.47 v318.5,180.3
  Route15 0.254: v248.4,252.95 249.92,252.95 272.78,230.09 272.78,228.56 299.2,202.15 303.26,202.15 310.88,194.53 310.88,188.94 311.39,188.43 311.39,187.41 313.93,184.87 313.93,183.35 314.94,182.33 316.47,182.33 v318.5,180.3
  Bottom 0.254: B03.D2 343.9,194.53 342.88,195.54 326.63,195.54 322.06,190.97 319.52,190.97 B05.E2 | v248.4,252.95 228.59,252.95 227.57,253.96 A12.H2
!FR_02  (via drill 0.61)
  Top 0.254: v319.01,146.27 317.99,147.28 317.99,154.9 v318.5,155.41
  Route2 0.254: v319.01,146.27 314.44,141.69 312.41,141.69 311.39,140.68 311.39,140.17 309.36,138.14 308.34,138.14 301.23,131.03 301.23,126.45 299.2,124.42 297.17,124.42 C07.F1 | v318.5,155.41 318.5,156.43 324.6,162.52 327.14,162.52 332.22,167.6 332.73,167.6 339.33,174.21 339.33,178.27 341.36,180.3 341.36,182.33 345.93,186.91 345.93,188.94 347.46,190.46 B03.E2
!FR_03  (via drill 0.61)
  Route2 0.254: 317.99,153.38 318.5,153.89 322.56,153.89 326.63,157.95 326.63,158.97 333.74,166.08 333.74,166.59 343.39,176.24 345.93,176.24 347.46,177.76 B03.K2 | 317.99,153.38 315.96,151.35 315.45,151.35 301.23,137.12 301.23,133.06 298.69,130.52 298.69,128.49 290.56,120.36 290.56,118.33 C07.J2 | 317.99,153.38 v316.47,153.38
  Route15 0.254: v316.47,153.38 313.93,155.92 313.93,159.47 309.36,164.05 308.34,163.03 308.34,161.51 310.88,158.97 310.88,153.38 308.85,151.35 305.8,151.35 298.69,158.46 298.69,159.47 297.17,161 296.15,161 289.55,167.6 288.53,167.6 278.37,177.76 278.37,180.81 B08.J2
!IM_00
  Top 0.254: 336.79,192.49 336.79,68.54 337.81,67.53 D04.B1 | 336.79,192.49 337.81,193.51 B04.D1 | 336.79,192.49 336.79,268.69 337.81,269.71 A04.B1
  Bottom 0.254: B03.D1 350.5,193.51 350,193 338.82,193 338.31,193.51 B04.D1
!IM_01  (via drill 0.61)
  Top 0.254: v384.54,105.12 384.54,125.44 385.56,126.45 385.56,181.83 v384.54,182.84
  Route2 0.254: v384.54,105.12 340.85,61.43 338.31,61.43 D04.D1 | v356.6,230.59 361.17,226.02 359.14,223.99 359.14,198.59 356.09,195.54 356.09,193.51 354.06,191.48 B03.E1
  Route15 0.254: v356.6,230.59 339.33,247.87 339.33,258.53 338.31,259.55 338.31,263.61 A04.D1
  Bottom 0.254: v384.54,182.84 377.94,189.45 355.59,189.45 | 355.59,189.45 354.57,190.46 B03.E1 | 355.59,189.45 342.88,189.45 341.87,190.46 B04.E1
!IM_02  (via drill 0.61)
  Top 0.254: v355.08,74.13 355.59,74.64 355.59,154.39 353.55,156.43 v353.55,156.93 | A04.E1 341.87,260.57 342.88,259.55 342.88,212.31 341.87,211.29 341.87,205.19 342.38,204.69 342.38,179.29 341.87,178.78 B04.K1
  Route2 0.254: v355.08,74.13 341.87,60.92 341.87,57.87 D04.E1 | v353.55,156.93 351.52,158.97 355.59,163.03 355.59,165.06 358.63,168.11 358.63,171.16 353.05,176.75 354.06,177.76 B03.K1
  Bottom 0.254: B04.K1 341.87,177.76 342.88,176.75 352.54,176.75 353.55,177.76 B03.K1
!IM_03  (via drill 0.61)
  Top 0.254: v371.84,83.78 371.84,124.93 368.79,127.98 368.79,158.46 v369.3,158.97
  Route2 0.254: v371.84,83.78 341.36,53.3 341.36,51.78 D04.H1 | A04.H1 341.87,254.47 343.39,254.47 379.97,217.89 379.46,217.39 379.46,206.21 352.54,179.29 352.54,177.25 351.01,175.73 B03.L1
  Route15 0.254: v369.3,158.97 355.08,173.19 352.54,173.19 351.01,174.71 B03.L1
  Bottom 0.254: B04.L1 338.31,175.73 338.82,176.24 350,176.24 350.5,175.73 B03.L1
!IM_04
  Top 0.254: 339.33,161 339.33,148.3 338.82,147.79 338.82,139.15 339.33,138.65 339.33,49.75 338.31,48.73 D04.J1 | 339.33,161 338.31,162.01 B04.R1 | 339.33,161 339.33,249.9 338.31,250.91 A04.J1
  Bottom 0.254: B03.R1 350.5,163.03 350,163.54 338.82,163.54 338.31,163.03 B04.R1
!IM_05  (via drill 0.61)
  Top 0.254: v380.99,53.81 382.51,55.33 382.51,91.91 381.49,92.93 381.49,102.07 382,102.58 382,118.83 381.49,119.34 v381.49,128.99
  Route2 0.254: A04.L1 338.31,245.33 338.31,249.39 339.33,250.41 339.33,254.47 340.85,255.99 342.88,255.99 384.03,214.85 382,212.81 382,183.35 372.35,173.7 370.82,173.7 361.17,164.05 357.11,164.05 356.09,163.03 356.09,161 354.57,159.47 B03.S1
  Route15 0.254: v381.49,128.99 381.49,134.07 373.87,141.69 370.82,141.69 365.24,147.28 363.71,147.28 356.09,154.9 356.09,157.44 354.57,158.97 B03.S1
  Bottom 0.254: v380.99,53.81 379.46,53.81 369.3,43.65 339.84,43.65 338.31,42.13 D04.L1 | B04.S1 341.87,159.47 342.88,160.49 352.54,160.49 353.55,159.47 B03.S1
!IM_06  (via drill 0.61)
  Top 0.254: v332.73,166.59 333.23,166.08 333.23,151.35 334.25,150.33 334.25,148.3 333.23,147.28 333.23,85.31 332.22,84.29 332.22,78.19 333.23,77.18 333.23,30.95 342.38,30.95 342.38,37.55 341.87,38.06 D04.M1
  Route2 0.254: v332.73,166.59 351.52,185.38 351.52,185.89 | 351.52,185.89 351.52,186.4 352.03,186.91 352.03,188.94 351.01,189.95 349.49,188.43 349.49,186.4 347.97,184.87 B03.H2 | v363.21,217.39 363.21,202.15 362.19,201.13 362.19,196.56 351.52,185.89
  Route15 0.254: v363.21,217.39 341.36,239.23 341.36,241.26 A04.M1
  Bottom 0.254: B04.H2 335.26,184.87 336.28,185.89 346.44,185.89 347.46,184.87 B03.H2
!IM_07  (via drill 0.61)
  Top 0.254: 339.84,180.3 339.84,150.33 342.88,147.28 342.88,113.25 342.38,112.74 342.38,74.13 339.84,71.59 339.84,33.49 340.85,32.47 D04.P1 | v340.35,180.81 339.84,180.3 | 339.84,180.3 339.84,234.15 340.85,235.17 A04.P1
  Bottom 0.254: 340.35,180.3 343.39,180.3 343.9,180.81 B03.J2 | 340.35,180.3 332.73,180.3 332.22,180.81 B04.J2 | 340.35,180.3 v340.35,180.81
!IM_08  (via drill 0.61)
  Top 0.254: v327.65,128.99 327.65,121.37 329.68,119.34 329.68,83.78 330.19,83.27 330.19,75.65 329.17,74.64 329.17,64.99 328.15,63.97 328.15,30.44 339.33,30.44 339.33,27.9 340.85,26.38 D04.S1
  Route2 0.254: v327.65,128.99 327.65,129.5 332.73,134.58 332.73,135.6 336.28,139.15 336.28,141.69 343.39,148.81 343.39,156.93 346.95,160.49 346.95,162.01 349.49,164.55 349.49,165.57 352.03,168.11 352.03,171.16 350.5,172.68 348.47,170.65 346.44,170.65 344.92,169.13 B03.N2 | v323.07,195.54 324.09,196.56 324.09,198.08 339.84,213.83 339.84,223.48 341.36,225.01 341.36,228.56 A04.S1
  Route15 0.254: v323.07,195.54 323.07,195.03 326.63,191.48 326.63,189.45 342.38,173.7 342.38,171.16 344.41,169.13 B03.N2
  Bottom 0.254: B04.N2 332.22,168.11 332.73,167.6 343.39,167.6 343.9,168.11 B03.N2
!IM_09  (via drill 0.61)
  Top 0.254: D04.D2 331.2,61.43 330.69,61.94 330.69,74.13 331.2,74.64 331.2,84.29 330.69,84.8 330.69,138.14 332.73,140.17 332.73,148.3 v333.23,148.81 333.23,150.33 330.69,152.87 330.69,194.02 330.19,194.53 330.19,262.6 331.2,263.61 A04.D2
  Route2 0.254: v333.23,148.81 345.93,161.51 345.93,163.54 347.46,165.06 B03.P2